# EAGLE board SB V1.2 (EAGLE 9.6.2), part 1 of 2
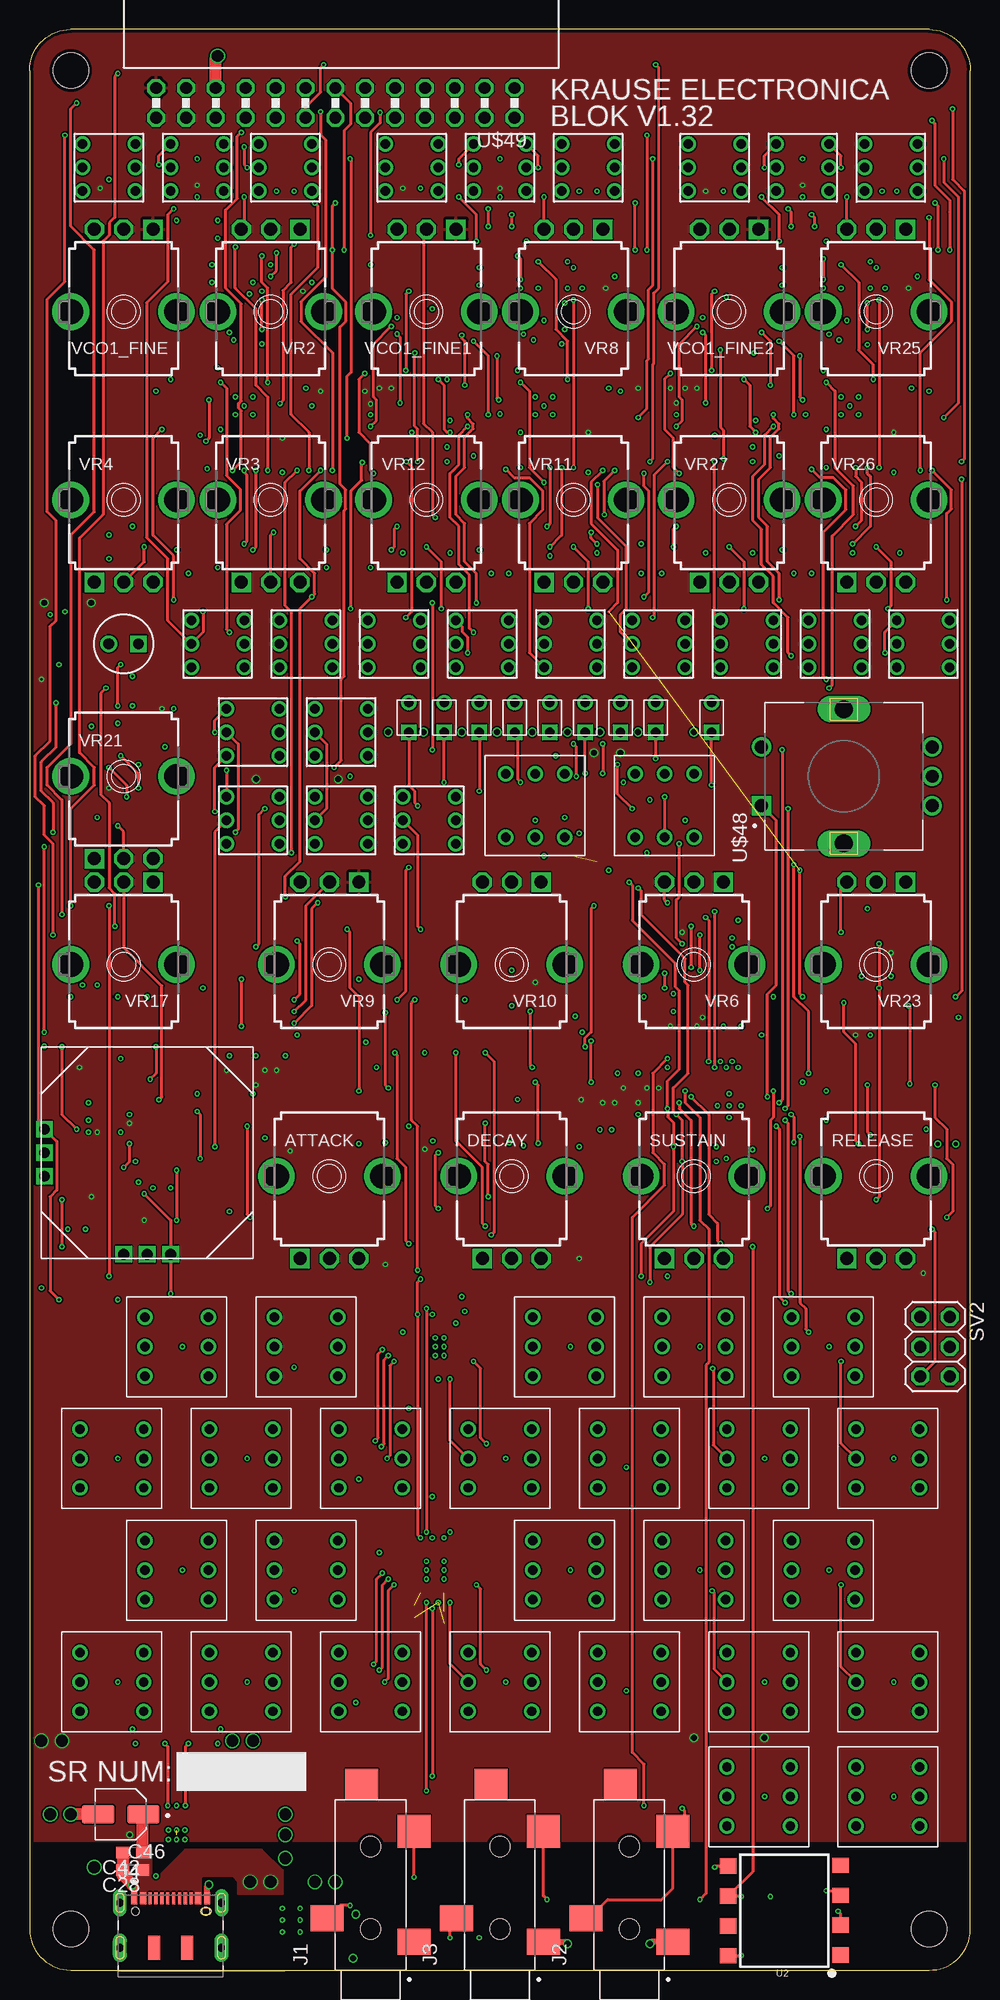
[diagram p5: board, top side]
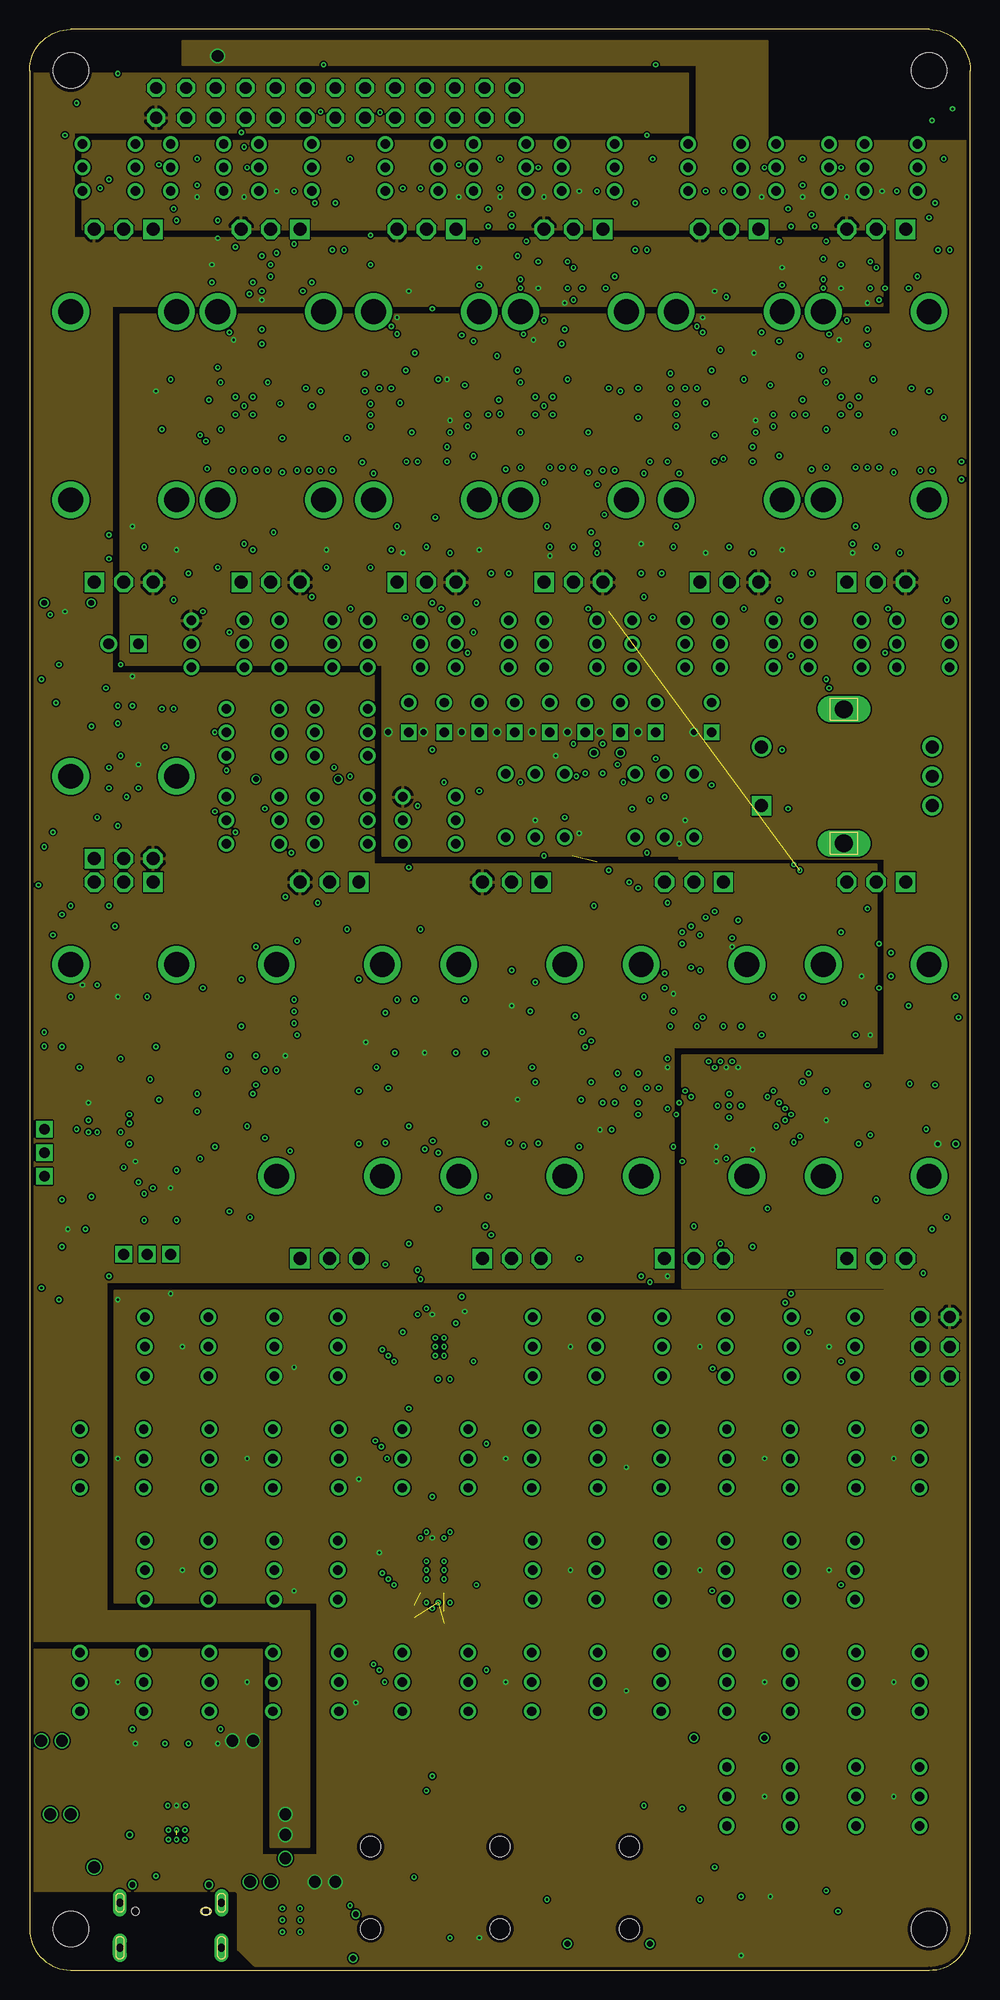
[diagram p6: board, inner layer Route2]
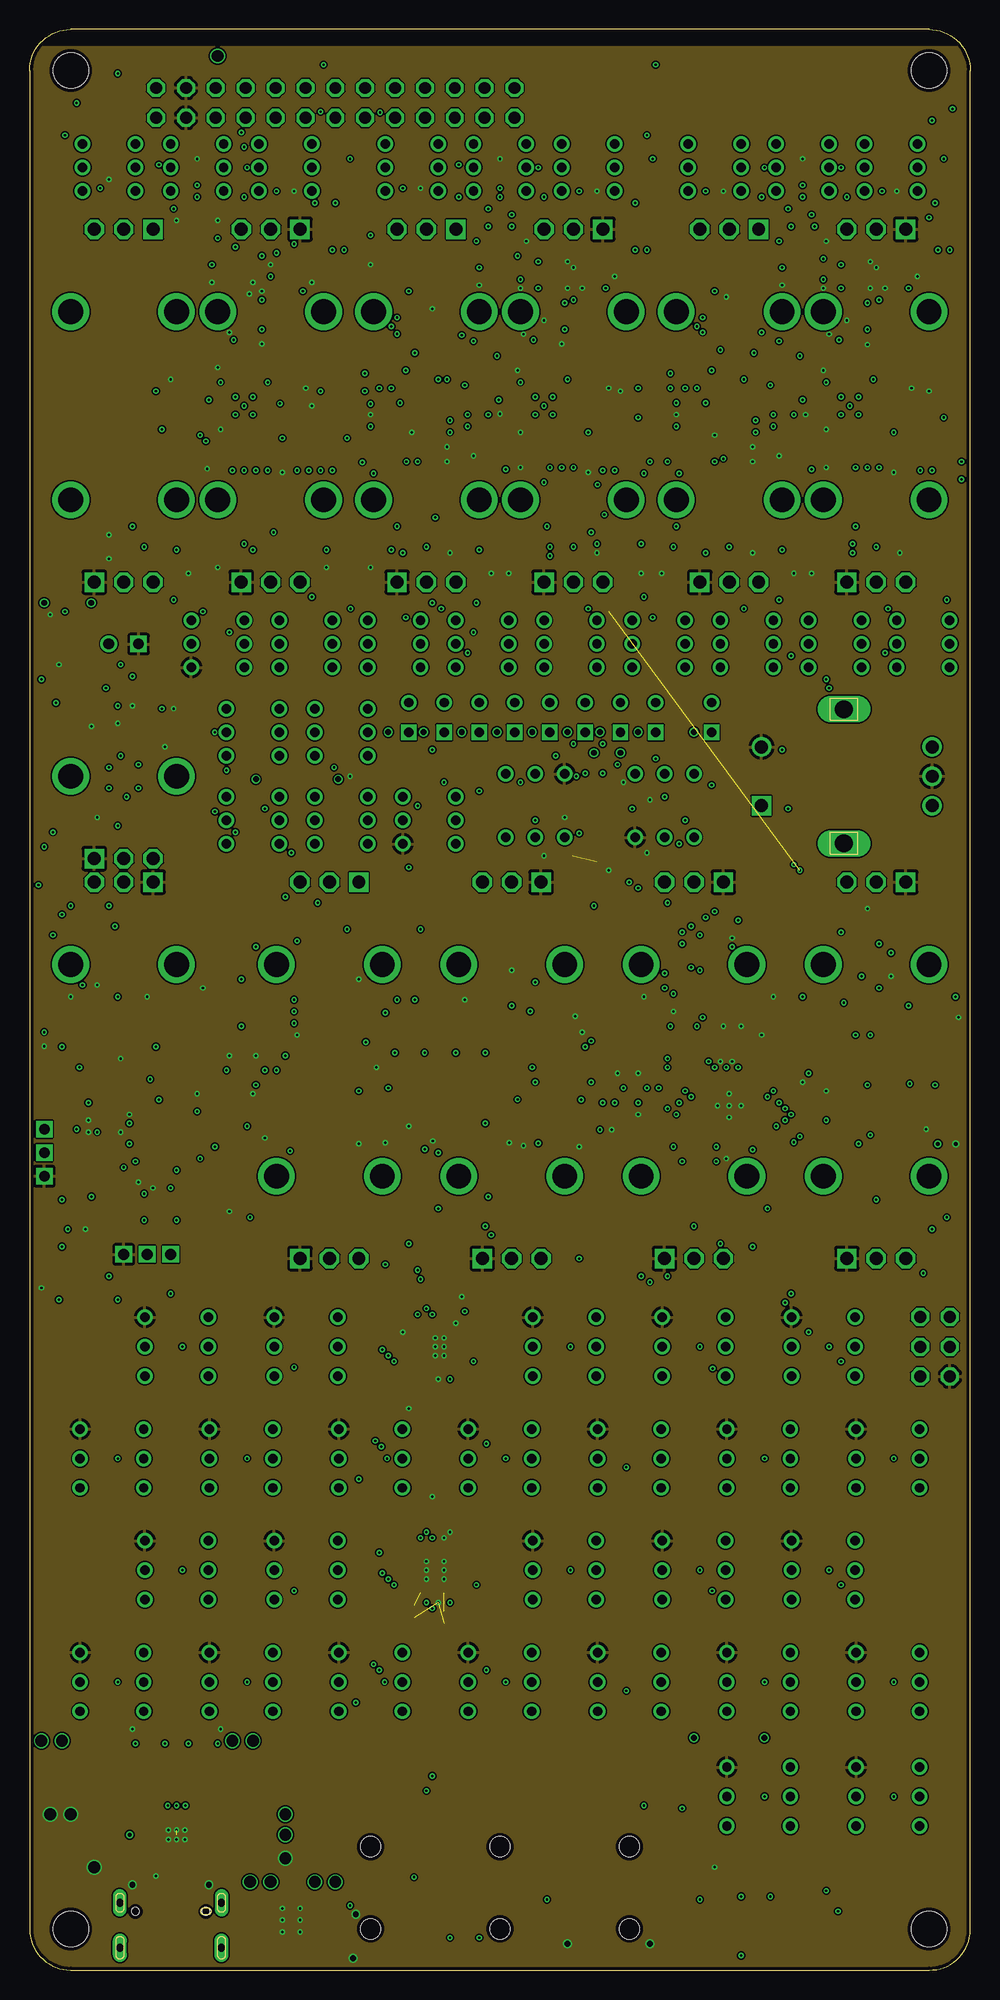
[diagram p7: board, inner layer Route15]
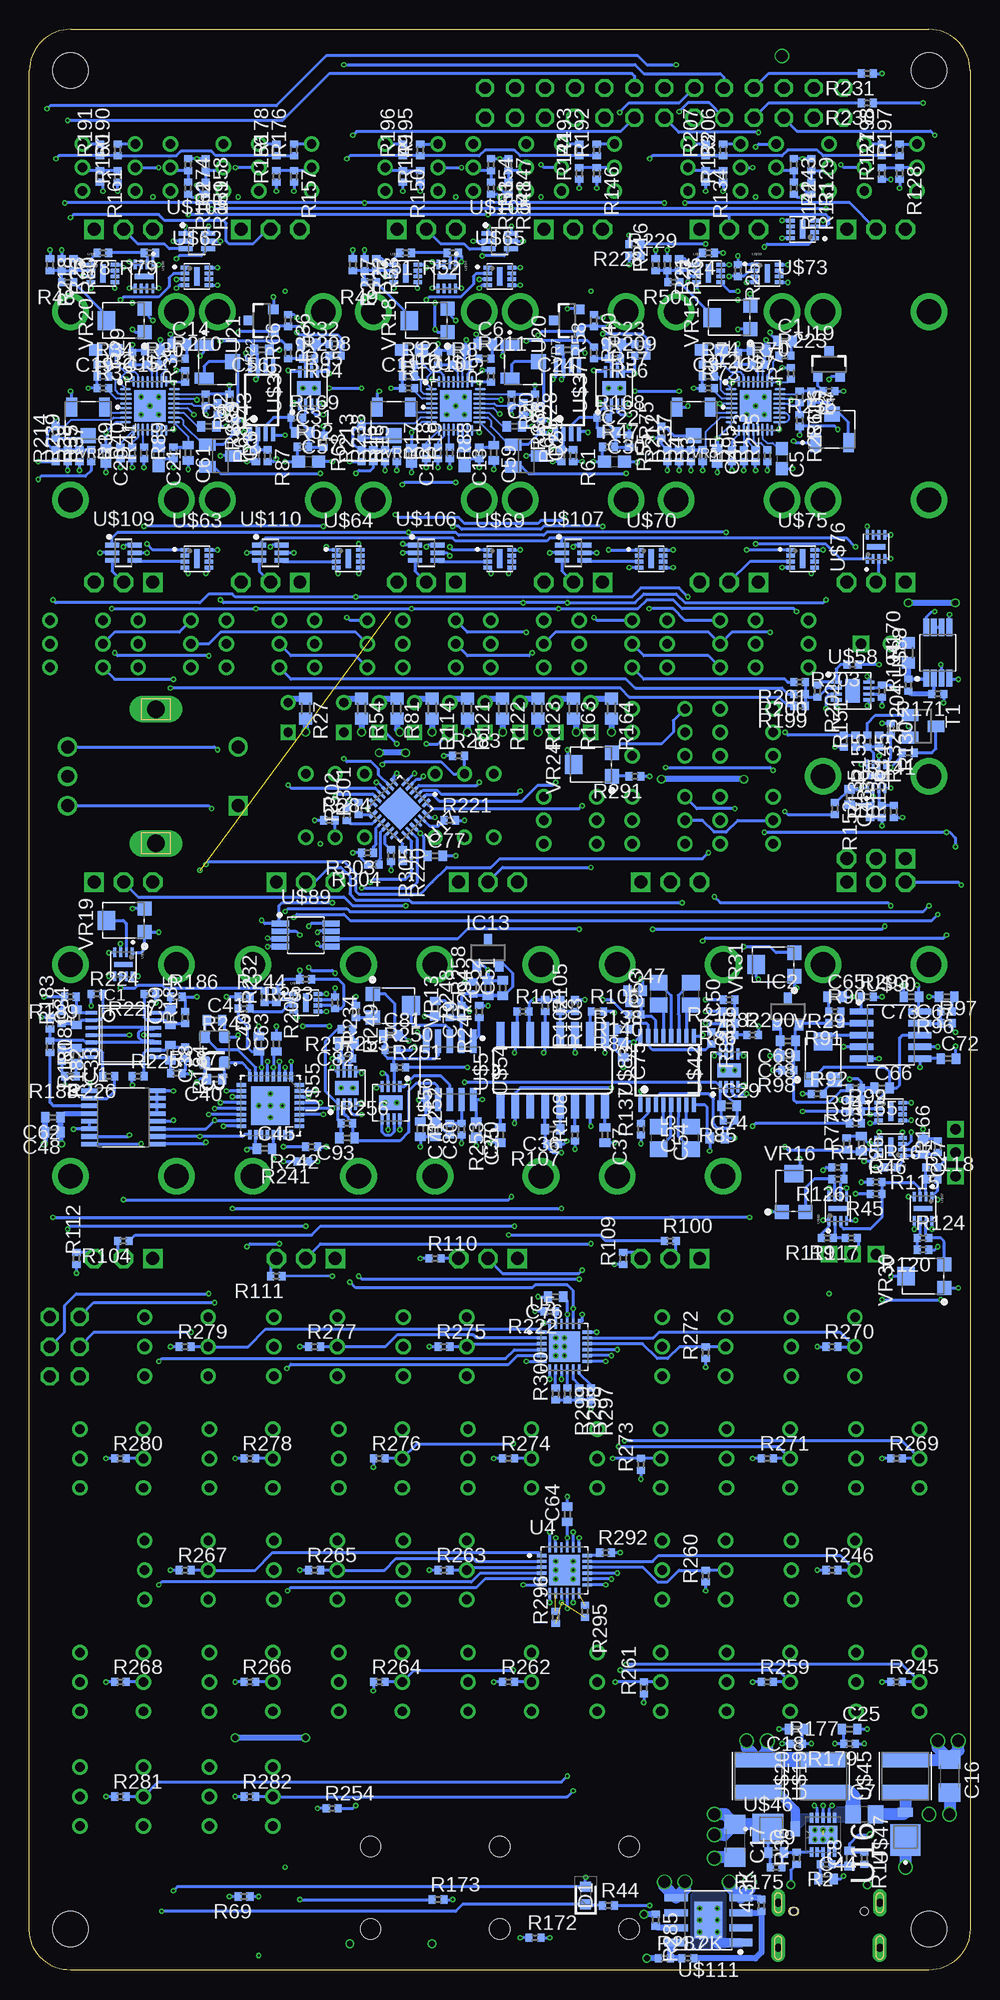
[diagram p8: board, bottom side, seen from below]

Size 80 x 165 mm. Coordinates in mm from the lower left corner, seen from the top.
Outline: 3.5,0 76.5,0 arc90 80,3.4 80,161.5 arc90 76.5,165 3.5,165 arc90 0,161.5 0,3.5 arc90 3.5,0
Copper layers (1+2*15+16): Top 0.035mm / dielectric 0.18mm / Route2 0.017mm / dielectric 1.2mm / Route15 0.017mm / dielectric 0.18mm / Bottom 0.035mm
Design rules "default *": minimum track width 5mil, minimum drill 0.2mm, track to track 5mil, track to pad 0.2mm, pad to pad 5mil, via to via 10mil, smd to smd 5mil, copper to edge 0.3mm, drill to drill 0.5mm, minimum pad ring 10mil, minimum via ring 0.125mm, stop-mask expansion 4mil, vias tented up to drill 0mil, thermal gap 10mil
Holes 3 mm at 76.5,3.5 3.5,3.5 3.5,161.5 76.5,161.5

## Footprints (pad centres in the part's own frame; a part is rotated, then mirrored left to right if it is on the bottom)
R0402 = smd 0.6 x 0.7: 1 -0.5,0; 2 0.5,0
TL2203 = drill 0.8: P$1 -2.25,2; P$2 -2.25,0; P$3 -2.25,-2; P$4 2.25,2; P$5 2.25,0; P$6 2.25,-2
9MM_SNAP-IN_POT = drill 1.1 square: 1 -2.5,-7 | drill 1.1 octagon: 2 0,-7; 3 2.5,-7 | drill 2.1 pad 2.794: CHASSIS1 -4.5,0; CHASSIS2 4.5,0
C0402 = smd 0.7 x 0.9: 1 -0.65,0; 2 0.65,0
C0603 = smd 1.1 x 1: 1 -0.85,0; 2 0.85,0
C0805 = smd 1.3 x 1.5: 1 -0.95,0; 2 0.95,0
C1206 = smd 1.6 x 1.8: 1 -1.4,0; 2 1.4,0
CAPAE430X610N = smd 2.76 x 1.58: 1 -1.925,0; 2 1.925,0
DIOC1608X75N = smd 0.85 x 0.95: 1 -0.75,0; 2 0.75,0
TSSOP14 = smd 0.305 x 0.991: 1 -1.905,-2.718; 2 -1.27,-2.718; 3 -0.635,-2.718; 4 0,-2.718; 5 0.635,-2.718; 6 1.27,-2.718; 7 1.905,-2.718; 8 1.905,2.718; 9 1.27,2.718; 10 0.635,2.718; 11 0,2.718; 12 -0.635,2.718; 13 -1.27,2.718; 14 -1.905,2.718
DBZ_R-PDSO-G3 = smd 0.7 x 1: 1 -0.95,-1.1; 2 0.95,-1.1; 3 0,1.1
CUI_SJ-3524-SMT = smd 2.2 x 2.8: 1 -1.1,-3.7; 3 0.9,3.7 | smd 2.8 x 2.8: 2 8.3,-3.7 | smd 2.6 x 2.8: 4 12.3,0.75 | hole 1.7: 0,0; 7,0
JAE_DX07S016JA1R1500 = smd 0.52 x 1: 1 -3.1,1.1; 2 -2.35,1.1; 11 2.35,1.1; 12 3.1,1.1 | smd 0.27 x 1: 3 -1.75,1.1; 4 -1.25,1.1; 5 -0.75,1.1; 6 -0.25,1.1; 7 0.25,1.1; 8 0.75,1.1; 9 1.25,1.1; 10 1.75,1.1 | smd 1 x 2: S1 -1.4,-3.1; S2 1.4,-3.1 | drill 0.65 long: S3 -4.32,0.725; S4 4.32,0.725 | drill 0.65 pad 1.2 long: S5 -4.32,-3.1; S6 4.32,-3.1 | hole 0.6: 3,0 | hole 0.63: 3,0; -3,0
SOT23-BEC = smd 1 x 1.4: B -0.95,-1.1; C 0,1.1; E 0.95,-1.1
R0603 = smd 1 x 1.1: 1 -0.85,0; 2 0.85,0
2X03 = drill 1.016 octagon: 1 -2.54,-1.27; 2 -2.54,1.27; 3 0,-1.27; 4 0,1.27; 5 2.54,-1.27; 6 2.54,1.27
SOT23 = smd 1 x 1.4: 1 -0.95,-1.1; 2 0.95,-1.1; 3 0,1.1
SOP65P640X120-16N = smd 1.57 x 0.41: 1 -2.87,2.275; 2 -2.87,1.625; 3 -2.87,0.975; 4 -2.87,0.325; 5 -2.87,-0.325; 6 -2.87,-0.975; 7 -2.87,-1.625; 8 -2.87,-2.275; 9 2.87,-2.275; 10 2.87,-1.625; 11 2.87,-0.975; 12 2.87,-0.325; 13 2.87,0.325; 14 2.87,0.975; 15 2.87,1.625; 16 2.87,2.275
8-SMD = smd 1.3 x 1.4: 1 -3.96,-4.96; 2 -1.42,-4.96; 3 1.12,-4.96; 4 3.66,-4.96; 5 3.59,4.58; 6 1.05,4.58; 7 -1.49,4.58; 8 -4.03,4.58
QFN50P500X500X100-33N = smd 0.813 x 0.305: 1 -2.464,1.753; 2 -2.464,1.245; 3 -2.464,0.762; 4 -2.464,0.254; 5 -2.464,-0.254; 6 -2.464,-0.762; 7 -2.464,-1.245; 8 -2.464,-1.753; 17 2.464,-1.753; 18 2.464,-1.245; 19 2.464,-0.762; 20 2.464,-0.254; 21 2.464,0.254; 22 2.464,0.762; 23 2.464,1.245; 24 2.464,1.753 | smd 0.305 x 0.813: 9 -1.753,-2.464; 10 -1.245,-2.464; 11 -0.762,-2.464; 12 -0.254,-2.464; 13 0.254,-2.464; 14 0.762,-2.464; 15 1.245,-2.464; 16 1.753,-2.464; 25 1.753,2.464; 26 1.245,2.464; 27 0.762,2.464; 28 0.254,2.464; 29 -0.254,2.464; 30 -0.762,2.464; 31 -1.245,2.464; 32 -1.753,2.464 | smd 3.251 x 3.251: 33 0,0
QFN50P400X400X80-25N = smd 0.86 x 0.27: 1 -1.935,1.25; 2 -1.935,0.75; 3 -1.935,0.25; 4 -1.935,-0.25; 5 -1.935,-0.75; 6 -1.935,-1.25; 13 1.935,-1.25; 14 1.935,-0.75; 15 1.935,-0.25; 16 1.935,0.25; 17 1.935,0.75; 18 1.935,1.25 | smd 0.27 x 0.86: 7 -1.25,-1.935; 8 -0.75,-1.935; 9 -0.25,-1.935; 10 0.25,-1.935; 11 0.75,-1.935; 12 1.25,-1.935; 19 1.25,1.935; 20 0.75,1.935; 21 0.25,1.935; 22 -0.25,1.935; 23 -0.75,1.935; 24 -1.25,1.935 | smd 2.6 x 2.6: 25 0,0
DFN300X300X80-11N = smd 0.813 x 0.305: 1 -1.448,0.991; 2 -1.448,0.508; 3 -1.448,0; 4 -1.448,-0.508; 5 -1.448,-0.991; 6 1.448,-0.991; 7 1.448,-0.508; 8 1.448,0; 9 1.448,0.508; 10 1.448,0.991 | smd 1.549 x 2.388: 11 0,0
SOT23-3 = smd 0.8 x 0.9: 1 -0.95,-1; 2 0.95,-1; 3 0,1.1
QFN40P400X400X80-33T270N = smd 0.951 x 0.22: 1 -2.089,1.4; 8 -2.089,-1.4; 24 2.089,1.4 | smd 1.051 x 0.22: 2 -2.039,1; 3 -2.039,0.6; 4 -2.039,0.2; 5 -2.039,-0.2; 6 -2.039,-0.6; 7 -2.039,-1; 17 2.039,-1.4; 18 2.039,-1; 19 2.039,-0.6; 20 2.039,-0.2; 21 2.039,0.2; 22 2.039,0.6; 23 2.039,1 | smd 0.22 x 0.951: 9 -1.4,-2.089; 16 1.4,-2.089; 25 1.4,2.089; 32 -1.4,2.089 | smd 0.22 x 1.051: 10 -1,-2.039; 11 -0.6,-2.039; 12 -0.2,-2.039; 13 0.2,-2.039; 14 0.6,-2.039; 15 1,-2.039; 26 1,2.039; 27 0.6,2.039; 28 0.2,2.039; 29 -0.2,2.039; 30 -0.6,2.039; 31 -1,2.039 | smd 2.7 x 2.7: 33 0,0
SON50P200X200X60-9N = smd 0.74 x 0.26: 1 -1.02,0.75; 2 -1.02,0.25; 3 -1.02,-0.25; 4 -1.02,-0.75; 5 1.02,-0.75; 6 1.02,-0.25; 7 1.02,0.25; 8 1.02,0.75 | smd 0.45 x 1.6: 9 0,0
SO16 = smd 0.66 x 2.032: 1 -4.445,-3.073; 2 -3.175,-3.073; 3 -1.905,-3.073; 4 -0.635,-3.073; 5 0.635,-3.073; 6 1.905,-3.073; 7 3.175,-3.073; 8 4.445,-3.073; 9 4.445,3.073; 10 3.175,3.073; 11 1.905,3.073; 12 0.635,3.073; 13 -0.635,3.073; 14 -1.905,3.073; 15 -3.175,3.073; 16 -4.445,3.073
LT2201 = drill 0.8: 1 -2.7,2.5; 2 -2.7,0; 3 -2.7,-2.5; 4 2.7,2.5; 5 2.7,0; 6 2.7,-2.5
INDDFN400X400X180-2N = smd 1.312 x 3.812: 1 -1.4,0; 2 1.4,0
TSSOP8 = smd 1.2 x 0.35: 1 -2.925,0.975; 2 -2.925,0.325; 3 -2.925,-0.325; 4 -2.925,-0.975; 5 2.925,-0.975; 6 2.925,-0.325; 7 2.925,0.325; 8 2.925,0.975
SON50P300X300X80-9T120X200N = smd 0.96 x 0.27: 1 -1.385,0.75; 2 -1.385,0.25; 3 -1.385,-0.25; 4 -1.385,-0.75; 5 1.385,-0.75; 6 1.385,-0.25; 7 1.385,0.25; 8 1.385,0.75 | smd 1.2 x 2: 9 0,0
DIO_MBRM110LT1G = smd 2.67 x 2.54: 1 -0.699,0 | smd 0.762 x 1.27: 2 1.653,0
XDCR_PEC11R-4215F-S0024 = drill 1.1 square: 1 -2.5,7 | drill 1.1: 2 2.5,7; A -2.5,-7.5; B 2.5,-7.5; COM 0,-7.5 | drill 1.5 long: S1 -5.7,0; S2 5.7,0
FE13-2W = drill 1.016 octagon: 1 -15.24,1.27; 2 -15.24,-1.27; 3 -12.7,1.27; 4 -12.7,-1.27; 5 -10.16,1.27; 6 -10.16,-1.27; 7 -7.62,1.27; 8 -7.62,-1.27; 9 -5.08,1.27; 10 -5.08,-1.27; 11 -2.54,1.27; 12 -2.54,-1.27; 13 0,1.27; 14 0,-1.27; 15 2.54,1.27; 16 2.54,-1.27; 17 5.08,1.27; 18 5.08,-1.27; 19 7.62,1.27; 20 7.62,-1.27; 21 10.16,1.27; 22 10.16,-1.27; 23 12.7,1.27; 24 12.7,-1.27; 25 15.24,1.27; 26 15.24,-1.27
WP914HDT = drill 0.8: A -1.27,0 | drill 0.8 square: C 1.27,0
SOP100P600X150-10N = smd 1.968 x 0.547: 1 -2.473,2; 2 -2.473,1; 3 -2.473,0; 4 -2.473,-1; 5 -2.473,-2; 6 2.473,-2; 7 2.473,-1; 8 2.473,0; 9 2.473,1; 10 2.473,2
WP483SRSGW = drill 0.9: P$1 -1.27,0 | drill 0.9 square: P$2 1.27,0
TSSOP16 = smd 0.35 x 1.2: 1 -2.275,-2.925; 2 -1.625,-2.925; 3 -0.975,-2.925; 4 -0.325,-2.925; 5 0.325,-2.925; 6 0.975,-2.925; 7 1.625,-2.925; 8 2.275,-2.925; 9 2.275,2.925; 10 1.625,2.925; 11 0.975,2.925; 12 0.325,2.925; 13 -0.325,2.925; 14 -0.975,2.925; 15 -1.625,2.925; 16 -2.275,2.925
ADAFRUIT-JOYSTICK = drill 0.9 square: P$1 -2,-8.75; P$2 0,-8.75; P$3 2,-8.75; P$4 8.65,2; P$5 8.65,0; P$6 8.65,-2
SOP65P490X110-8N = smd 1.471 x 0.497: 1 -2.15,0.975; 2 -2.15,0.325; 3 -2.15,-0.325; 4 -2.15,-0.975; 5 2.15,-0.975; 6 2.15,-0.325; 7 2.15,0.325; 8 2.15,0.975
SOP65P490X110-8N' = smd 1.471 x 0.481: 1 -2.15,0.975; 2 -2.15,0.325; 3 -2.15,-0.325; 4 -2.15,-0.975; 5 2.15,-0.975; 6 2.15,-0.325; 7 2.15,0.325; 8 2.15,0.975
SOT65P210X110-6N = smd 1.186 x 0.397: 1 -0.962,0.65; 2 -0.962,0; 3 -0.962,-0.65; 4 0.962,-0.65; 5 0.962,0; 6 0.962,0.65
SOIC127P600X170-9T240X310N = smd 1.968 x 0.602: 1 -2.75,1.905; 2 -2.75,0.635; 3 -2.75,-0.635; 4 -2.75,-1.905; 5 2.75,-1.905; 6 2.75,-0.635; 7 2.75,0.635; 8 2.75,1.905 | smd 2.4 x 3.1: 9 0,0
TRIM_3223W-1-501 = smd 0.9 x 1.6: 1 -1.4,-1.14; 3 1.4,-1.14 | smd 1.3 x 1.3: 2 0,1.29
TRIMMER_TC33X-2-103G = smd 1.2 x 1.2: 1 -1,-1.8; 3 1,-1.8 | smd 1.6 x 1.5: 2 0,1.45
OSCSC320X250X100N = smd 0.98 x 1.1: 1 -0.85,1.1; 2 -0.85,-1.1; 3 0.85,-1.1; 4 0.85,1.1

## Placement (x,y rotation side)
1.2K  1K  [R0402]  24,1 0 bottom
1_DOWN  TL2203  [TL2203]  6.75,153.25 0 top
1_UP  TL2203  [TL2203]  21.75,153.25 0 top
2_DOWN  TL2203  [TL2203]  32.5,153.25 0 top
2_UP  TL2203  [TL2203]  47.5,153.25 0 top
3_DOWN  TL2203  [TL2203]  58.25,153.25 0 top
3_UP  TL2203  [TL2203]  73.25,153.25 0 top
4.3K  20K  [R0402]  17.75,5.5 90 bottom
ATTACK  100K  [9MM_SNAP-IN_POT]  25.5,67.5 0 top
C1  10nF  [C0402]  15.75,138.5 0 bottom
C2  0.1uF  [C0402]  18,137.75 180 bottom
C3  10uF  [C0603]  22,137.75 180 bottom
C4  0.1uF  [C0402]  21.5,128.75 270 bottom
C5  3.9nF  [C0603]  16,128.5 270 bottom
C6  10nF  [C0402]  41.25,138.25 0 bottom
C7  1uF  [C0805]  9,13.25 0 bottom
C8  56pF  [C0402]  10.25,9.5 90 bottom
C9  56pF  [C0402]  16.5,10 0 bottom
C10  0.1uF  [C0402]  43.5,137.75 180 bottom
C11  10uF  [C0603]  47.5,137.75 180 bottom
C12  0.1uF  [C0402]  47.5,128.75 270 bottom
C13  3.9nF  [C0603]  43,128.75 270 bottom
C14  10nF  [C0402]  67.25,138.25 0 bottom
C15  0.1uF  [C0402]  69.5,137.75 180 bottom
C16  4.7uF  [C1206]  1.75,16.5 270 bottom
C17  4.7uF  [C1206]  20,11 270 bottom
C18  0.33uF  [C0402]  14.75,20.5 180 bottom
C19  10uF  [C0603]  73.5,137.75 180 bottom
C20  0.1uF  [C0402]  73.5,128.75 270 bottom
C21  3.9nF  [C0603]  69,128.75 270 bottom
C22  100pF  [C0402]  30.75,130.75 0 bottom
C23  100pF  [C0402]  30.25,138.25 0 bottom
C24  100pF  [C0402]  34.25,137.75 180 bottom
C25  0.33uF  [C0402]  10.25,20.5 0 bottom
C26  100p  [C0402]  9.25,70.25 270 bottom
C27  47p  [C0402]  4,70 270 bottom
C28  10nF  [C0603]  8.75,8.5 180 top
C29  100pF  [C0402]  20.5,73.5 0 bottom
C30  10uF  [C0603]  30.25,128.25 0 bottom
C31  100pF  [C0402]  56.75,130.75 0 bottom
C32  100pF  [C0402]  56.25,138.25 0 bottom
C33  18pF  [C0402]  76,77.75 270 bottom
C34  18pF  [C0402]  76,81 90 bottom
C35  39nF  [C0402]  39.95,71 270 bottom
C36  3nF  [C0402]  35.5,71.5 180 bottom
C37  10nF  [C0402]  31.05,71 270 bottom
C38  18pF  [C0402]  68,78 270 bottom
C39  18pF  [C0402]  68,81 90 bottom
C40  10pF  [C0402]  64.25,75.75 180 bottom
C41  10pF  [C0402]  64.25,80.75 0 bottom
C42  100nF  [C0603]  8.75,10 180 top
C43  100nF  [C0402]  10.25,99.75 270 bottom
C44  100nF  [C0402]  12.25,7.75 0 bottom
C45  100nF  [C0402]  60,69.85 0 bottom
C46  EEE-FK1E100R  [CAPAE430X610N]  7.75,13.25 180 top
C47  10nF  [C0402]  28.5,83.25 0 bottom
C48  100n  [C0402]  78,71.25 180 bottom
C49  100nF  [C0402]  60.5,78.75 90 bottom
C50  6.8nF  [C0805]  23.75,83 270 bottom
C51  470pF  [C0402]  39.75,83.5 90 bottom
C52  470pF  [C0402]  41,83.5 90 bottom
C53  6.8nF  [C0805]  26.5,83 90 bottom
C54  560pF  [C0805]  26.5,70.75 270 bottom
C55  6.8nF  [C0805]  23.75,70.75 90 bottom
C56  100pF  [C0402]  60.25,137.75 180 bottom
C57  10uF  [C0603]  56.25,128.25 0 bottom
C58  10nF  [C0402]  38.75,131.25 0 bottom
C59  10nF  [C0402]  40.5,129 270 bottom
C60  10nF  [C0402]  64.75,131.25 0 bottom
C61  10nF  [C0402]  66.5,129 270 bottom
C62  220nF  [C0402]  78,72.5 180 bottom
C63  [C0402]  59,78.75 90 bottom
C64  100nF  [C0402]  34.25,38.75 90 bottom
C65  560p  [C0402]  11.5,82.75 0 bottom
C66  47p  [C0402]  7.5,75 0 bottom
C67  560p  [C0402]  2,82.75 180 bottom
C68  470pF  [C0402]  15.5,77.75 180 bottom
C69  470pF  [C0402]  15.5,79 180 bottom
C70  10nF  [C0402]  42,71.5 270 bottom
C71  10nF  [C0402]  46.75,71.5 270 bottom
C72  10nF  [C0402]  1.85,77.5 0 bottom
C73  10nF  [C0402]  5,82.75 180 bottom
C74  10nF  [C0402]  21.5,70.75 0 bottom
C75  10nF  [C0402]  29.5,78.25 270 bottom
C76  100nF  [C0402]  35.25,57.25 180 bottom
C77  100nF  [C0402]  45.5,94.75 0 bottom
C79  560p  [C0402]  45.5,81.75 270 bottom
C80  560p  [C0402]  45.5,71.5 270 bottom
C81  47p  [C0402]  49.25,79.5 0 bottom
C82  100p  [C0402]  53,78.75 180 bottom
C93  47p  [C0402]  53,70.75 180 bottom
D1  TS4148C_RZG  [DIOC1608X75N]  32.7,6.35 90 bottom
DECAY  100K  [9MM_SNAP-IN_POT]  41,67.5 0 top
IC1  TL074  [TSSOP14]  72,79.5 270 bottom
IC2  LM4040C25  [DBZ_R-PDSO-G3]  15.5,81.5 0 bottom
IC13  LM4040C25  [DBZ_R-PDSO-G3]  41,86.5 0 bottom
J1  SJ-3524-SMT  [CUI_SJ-3524-SMT]  29,3.5 90 top
J2  SJ-3524-SMT  [CUI_SJ-3524-SMT]  51,3.5 90 top
J3  SJ-3524-SMT  [CUI_SJ-3524-SMT]  40,3.5 90 top
J4  DX07S016JA1R1500  [JAE_DX07S016JA1R1500]  12,5 0 top
Q2  2N7002SOT-23  [SOT23-BEC]  37.75,128.75 270 bottom
Q3  2N7002SOT-23  [SOT23-BEC]  63.75,128.75 270 bottom
R1  20K  [R0402]  19.75,137 90 bottom
R2  15K  [R0402]  12.25,9 180 bottom
R3  49.9K  [R0402]  22.75,128.75 90 bottom
R4  49.9K  [R0402]  23.75,128.75 90 bottom
R5  100K  [R0402]  20.25,128.75 90 bottom
R6  20K  [R0402]  45.25,137 90 bottom
R7  22.1K  [R0402]  13.5,133.75 270 bottom
R8  20K  [R0402]  43.5,136.5 0 bottom
R9  10K  [R0402]  40.75,135.5 90 bottom
R10  4.75K  [R0402]  47.75,135.5 0 bottom
R11  4.75K  [R0402]  47.75,134.5 0 bottom
R12  4.02K  [R0402]  47.75,136.5 0 bottom
R13  267K  [R0402]  51.75,130.75 270 bottom
R14  182K  [R0402]  9,9.5 270 bottom
R15  49.9K  [R0402]  48.75,128.75 90 bottom
R16  49.9K  [R0402]  49.75,128.75 90 bottom
R17  100K  [R0402]  46.25,129 90 bottom
R18  100K  [R0402]  45.25,129 90 bottom
R19  100K  [R0402]  44.25,129 90 bottom
R20  499K  [R0402]  39,133.5 270 bottom
R21  20K  [R0402]  25.75,145 270 bottom
R22  20K  [R0402]  51.5,145 270 bottom
R23  20K  [R0402]  77.25,145 270 bottom
R24  100K  [R0402]  22.25,146 180 bottom
R25  20K  [R0402]  19.75,144.5 270 bottom
R26  10K  [R0402]  24.75,145 270 bottom
R27  300  [R0603]  56.5,107.25 270 bottom
R28  22.1K  [R0402]  37,133.5 270 bottom
R29  20K  [R0402]  71.25,137 90 bottom
R30  20K  [R0402]  69.5,136.5 0 bottom
R31  10K  [R0402]  66.75,135.5 90 bottom
R32  4.75K  [R0402]  73.75,135.5 0 bottom
R33  4.75K  [R0402]  73.75,134.5 0 bottom
R34  4.02K  [R0402]  73.75,136.5 0 bottom
R35  267K  [R0402]  77.75,130.75 270 bottom
R36  4.99K  [R0402]  14.75,9.5 90 bottom
R37  49.9K  [R0402]  74.75,128.75 90 bottom
R38  49.9K  [R0402]  75.75,128.75 90 bottom
R39  100K  [R0402]  72.25,129 90 bottom
R40  100K  [R0402]  71.25,129 90 bottom
R41  100K  [R0402]  70.25,129 90 bottom
R42  499K  [R0402]  65,133.5 270 bottom
R43  22.1K  [R0402]  63,133.5 270 bottom
R44  220  [R0402]  30.75,5.5 0 bottom
R45  10K  [R0402]  8,66 180 bottom
R46  10K  [R0402]  8,67 0 bottom
R47  20K  [R0402]  30.75,129.5 0 bottom
R48  10K  [R0402]  76.75,143.5 180 bottom
R49  10K  [R0402]  51,143.5 180 bottom
R50  10K  [R0402]  25.2,143.5 180 bottom
R51  100K  [R0402]  48,146 180 bottom
R52  20K  [R0402]  44,146 180 bottom
R53  10K  [R0402]  50.5,145 270 bottom
R54  300  [R0603]  51.75,107.25 270 bottom
R55  20K  [R0402]  29,130 270 bottom
R56  20K  [R0402]  28,137.25 180 bottom
R57  20K  [R0402]  28,138.25 180 bottom
R58  500K  [R0402]  32,137.5 90 bottom
R59  10K  [R0402]  36.5,131.25 270 bottom
R60  100  [R0402]  34.75,128.75 90 bottom
R61  100K  [R0402]  33.75,128.75 270 bottom
R62  20K  [R0402]  56.75,129.5 0 bottom
R63  20K  [R0402]  55,130 270 bottom
R64  20K  [R0402]  54,137.25 180 bottom
R65  20K  [R0402]  54,138.25 180 bottom
R66  500K  [R0402]  58,137.5 90 bottom
R67  10K  [R0402]  62.5,131.25 270 bottom
R68  100  [R0402]  60.75,128.75 90 bottom
R69  10K  [R0402]  61.75,6.25 180 bottom
R70  20K  [R0402]  18,136.5 0 bottom
R71  10K  [R0402]  15.25,135.75 90 bottom
R72  4.75K  [R0402]  22.25,135.5 0 bottom
R73  4.75K  [R0402]  22.25,134.5 0 bottom
R74  4.02K  [R0402]  22.25,136.5 0 bottom
R75  267K  [R0402]  26.25,130.75 90 bottom
R76  100K  [R0402]  20.5,81.5 180 bottom
R77  5.1k  [R0402]  10.5,70.25 90 bottom
R78  100K  [R0402]  73.75,146 180 bottom
R79  20K  [R0402]  69.75,146 180 bottom
R80  10K  [R0402]  76.25,145 270 bottom
R81  300  [R0603]  48.75,107.25 270 bottom
R82  100K  [R0402]  20.5,79.5 0 bottom
R83  133K  [R0402]  22,79.25 270 bottom
R84  1K  [R0402]  29.5,80 180 bottom
R85  33.2K  [R0402]  20.5,72.25 180 bottom
R86  100K  [R0402]  20.5,80.5 180 bottom
R87  100K  [R0402]  59.75,128.75 270 bottom
R88  10K  [R0402]  41.75,129 90 bottom
R89  10K  [R0402]  67.75,129 90 bottom
R90  510  [R0402]  11.5,81.5 0 bottom
R91  49.9k  [R0402]  11.5,80.5 180 bottom
R92  510  [R0402]  13,74.5 0 bottom
R93  100k  [R0402]  9.75,74 180 bottom
R94  20M  [R0402]  9.75,75 180 bottom
R95  100K  [R0402]  19.25,128.75 90 bottom
R96  510  [R0402]  2,81.5 180 bottom
R97  100k  [R0402]  2,80.5 0 bottom
R98  24K  [R0402]  15.5,76.5 180 bottom
R99  100K  [R0402]  9.75,73 0 bottom
R100  10K  [R0402]  25.5,62 0 bottom
R101  470R  [R0402]  38.03,81.5 0 bottom
R102  470R  [R0402]  36.13,82 270 bottom
R103  470R  [R0402]  34.87,82 270 bottom
R104  10K  [R0402]  72,62 180 bottom
R105  10K  [R0402]  33.59,82 90 bottom
R106  30K  [R0402]  31.69,81.5 0 bottom
R107  10K  [R0402]  35.5,70.25 180 bottom
R108  620R  [R0402]  33.59,71 90 bottom
R109  4.3M  [R0402]  29.5,60.5 90 bottom
R110  20M  [R0402]  45.5,60.5 0 bottom
R111  240K  [R0402]  59,59 180 bottom
R112  1.8M  [R0402]  76,60.5 90 bottom
R113  100K  [R0402]  18.25,128.75 90 bottom
R114  300  [R0603]  45.75,107.25 270 bottom
R115  10K  [R0402]  3.25,68.25 180 bottom
R116  499K  [R0402]  14.5,133.75 270 bottom
R117  10K  [R0402]  10.1,62.25 180 bottom
R118  10K  [R0402]  3.25,67.25 0 bottom
R119  10K  [R0402]  12.15,62.25 180 bottom
R120  10K  [R0402]  4,61.25 180 bottom
R121  300  [R0603]  42.75,107.25 270 bottom
R122  300  [R0603]  39.75,107.25 270 bottom
R123  300  [R0603]  36.75,107.25 270 bottom
R124  10K  [R0402]  4,62.25 0 bottom
R125  10K  [R0402]  11.25,68.25 0 bottom
R126  10K  [R0402]  11.25,67.25 180 bottom
R127  1K  [R0402]  7.5,152.75 90 bottom
R128  11K  [R0402]  6,152.75 270 bottom
R129  1K  [R0402]  13.5,153.5 270 bottom
R130  47K  [R0402]  6.75,105.5 270 bottom
R131  11K  [R0402]  13.5,151.5 270 bottom
R132  47K  [R0402]  7.75,104.5 270 bottom
R133  12K  [R0402]  21,152.5 90 bottom
R134  3K  [R0402]  22.5,152.5 270 bottom
R135  100K  [R0402]  8.5,98.5 90 bottom
R136  47K  [R0402]  6.5,98.5 90 bottom
R137  200  [R0402]  28,71.5 90 bottom
R138  499  [R0402]  28.5,82.25 180 bottom
R139  47K  [R0402]  7.5,98.5 90 bottom
R140  26.7K  [R0402]  28.5,81.25 180 bottom
R141  47K  [R0402]  5.25,103.5 180 bottom
R142  12K  [R0402]  15,151.5 270 bottom
R143  3K  [R0402]  15,153.5 270 bottom
R144  1K  [R0402]  33.25,152.75 90 bottom
R145  100K  [R0402]  8.75,104.5 270 bottom
R146  11K  [R0402]  31.75,152.75 270 bottom
R147  1K  [R0402]  39.25,153.5 270 bottom
R148  11K  [R0402]  39.25,151.5 270 bottom
R149  12K  [R0402]  46.75,152.5 90 bottom
R150  3K  [R0402]  48.25,152.5 270 bottom
R151  100K  [R0402]  9.75,104.5 90 bottom
R152  1K  [R0402]  11.5,98.75 270 bottom
R153  12K  [R0402]  40.75,151.5 270 bottom
R154  3K  [R0402]  40.75,153.5 270 bottom
R155  100K  [R0402]  10.75,104.5 270 bottom
R156  1K  [R0402]  59,152.5 90 bottom
R157  11K  [R0402]  57.5,152.5 270 bottom
R158  1K  [R0402]  65,153.5 270 bottom
R159  11K  [R0402]  65,151.5 270 bottom
R160  12K  [R0402]  72.5,152.5 90 bottom
R161  3K  [R0402]  74,152.5 270 bottom
R162  12K  [R0402]  66.5,151.5 270 bottom
R163  300  [R0603]  33.75,107.25 270 bottom
R164  300  [R0603]  30.5,107.25 270 bottom
R165  100K  [R0402]  9.75,72 0 bottom
R166  100k  [R0402]  2.75,70 90 bottom
R167  5.1k  [R0402]  6.75,68.25 0 bottom
R168  20K  [R0402]  31.25,132 0 bottom
R169  20K  [R0402]  57.25,132 0 bottom
R170  400  [R0603]  5.25,112 90 bottom
R171  10K  [R0402]  2.75,108.5 180 bottom
R172  51  [R0402]  37,2.75 0 bottom
R173  51  [R0402]  45.25,6 0 bottom
R174  3K  [R0402]  66.5,153.5 270 bottom
R175  54.9K  [R0402]  16.5,8.75 180 bottom
R176  49.9K  [R0402]  57.5,154.75 90 bottom
R177  4.7K  [R0402]  14.75,19.25 0 bottom
R178  49.9K  [R0402]  59,154.75 90 bottom
R179  4.7K  [R0402]  10.25,19.25 180 bottom
R180  10K  [R0402]  78.25,78.5 270 bottom
R181  10K  [R0402]  78.25,80.5 270 bottom
R182  240K  [R0402]  77.25,77.75 270 bottom
R183  240K  [R0402]  77.25,81 90 bottom
R184  240K  [R0402]  66.75,78 270 bottom
R185  240K  [R0402]  66.75,81 90 bottom
R186  1K  [R0402]  67.5,82.75 0 bottom
R187  1K  [R0402]  67.5,76.25 0 bottom
R188  1K  [R0402]  76.5,76 180 bottom
R189  1K  [R0402]  76.5,82.75 180 bottom
R190  49.9K  [R0402]  72.5,154.75 90 bottom
R191  49.9K  [R0402]  74,154.75 90 bottom
R192  49.9K  [R0402]  31.75,154.75 90 bottom
R193  49.9K  [R0402]  33.25,154.75 90 bottom
R194  10K  [R0402]  5.25,109.25 90 bottom
R195  49.9K  [R0402]  46.75,154.75 90 bottom
R196  49.9K  [R0402]  48.25,154.75 90 bottom
R197  49.9K  [R0402]  6,154.75 90 bottom
R198  49.9K  [R0402]  7.5,154.75 90 bottom
R199  10K  [R0402]  14.5,107.5 180 bottom
R200  10K  [R0402]  14.5,108.5 180 bottom
R201  10K  [R0402]  14.5,109.5 180 bottom
R202  10K  [R0402]  13,108.75 270 bottom
R203  1M  [R0402]  10,111 180 bottom
R204  3.9K  [R0402]  7.5,108.75 270 bottom
R205  47K  [R0402]  59,82.75 270 bottom
R206  49.9K  [R0402]  21,154.75 90 bottom
R207  49.9K  [R0402]  22.5,154.75 90 bottom
R208  20K  [R0402]  56.25,137 0 bottom
R209  20K  [R0402]  30.25,137 0 bottom
R210  10nF  [R0402]  67.25,137 0 bottom
R211  267  [R0402]  41.25,137 0 bottom
R212  49.9K  [R0402]  25.75,128.75 90 bottom
R213  49.9K  [R0402]  51.75,128.75 90 bottom
R214  49.9K  [R0402]  77.75,128.75 90 bottom
R215  100K  [R0402]  17.25,128.75 90 bottom
R216  20K  [R0402]  26.75,145 90 bottom
R217  20K  [R0402]  52.5,145 270 bottom
R218  20K  [R0402]  78.25,145 270 bottom
R219  100K  [R0402]  20.5,82.5 180 bottom
R220  10K  [R0402]  48.25,94.75 270 bottom
R221  10K  [R0402]  44.25,97.75 0 bottom
R222  10K  [R0402]  35.75,56 180 bottom
R223  267  [R0402]  15.75,137.25 0 bottom
R224  47K  [R0402]  74.25,83 0 bottom
R225  47K  [R0402]  70.75,76 0 bottom
R226  47K  [R0402]  73.25,76 180 bottom
R227  47K  [R0402]  69.75,83 180 bottom
R228  60K  [R0402]  28.5,146.75 180 bottom
R229  20K  [R0402]  28.5,145.75 0 bottom
R230  100K  [R0402]  8.75,158.75 180 bottom
R231  100K  [R0402]  8.75,161.25 180 bottom
R232  10K  [R0402]  60,82.75 90 bottom
R233  10K  [R0402]  56.5,84.25 180 bottom
R234  10K  [R0402]  54,82.25 270 bottom
R235  90  [R0402]  12,134.25 180 bottom
R236  90  [R0402]  58,140.25 270 bottom
R237  49.9K  [R0402]  24.75,128.75 90 bottom
R238  49K  [R0402]  50.75,128.75 90 bottom
R239  49.9K  [R0402]  76.75,128.75 90 bottom
R240  90  [R0402]  32,140.25 270 bottom
R241  4.7K  [R0402]  56.75,68.75 180 bottom
R242  4.7K  [R0402]  56,70 180 bottom
R243  10K  [R0402]  61.75,81.75 180 bottom
R244  10K  [R0402]  61.75,82.75 0 bottom
R245  10K  [R0402]  6.25,24.5 0 bottom
R246  10K  [R0402]  11.75,34 0 bottom
R247  510  [R0402]  44.25,81.5 270 bottom
R248  49.9k  [R0402]  43.25,81.5 90 bottom
R249  510  [R0402]  52.25,81.5 270 bottom
R250  100k  [R0402]  49.25,78.25 0 bottom
R251  20M  [R0402]  48.5,76.75 0 bottom
R252  510  [R0402]  44.25,71.5 90 bottom
R253  100k  [R0402]  43.25,71.5 270 bottom
R254  510  [R0402]  54.25,13.75 0 bottom
R255  5.1k  [R0402]  53,77.5 0 bottom
R256  100k  [R0402]  53,72 0 bottom
R257  5.1k  [R0402]  53,80 180 bottom
R258  24K  [R0402]  42.25,83.5 90 bottom
R259  10K  [R0402]  17.25,24.5 0 bottom
R260  10K  [R0402]  22.5,33.5 90 bottom
R261  10K  [R0402]  27.75,24 90 bottom
R262  10K  [R0402]  39.25,24.5 0 bottom
R263  10K  [R0402]  44.75,34 0 bottom
R264  10K  [R0402]  50.25,24.5 0 bottom
R265  10K  [R0402]  55.75,34 0 bottom
R266  10K  [R0402]  61.25,24.5 0 bottom
R267  10K  [R0402]  66.75,34 0 bottom
R268  10K  [R0402]  72.25,24.5 0 bottom
R269  10K  [R0402]  6.25,43.5 0 bottom
R270  10K  [R0402]  11.75,53 0 bottom
R271  10K  [R0402]  17.25,43.5 0 bottom
R272  10K  [R0402]  22.5,52.5 90 bottom
R273  10K  [R0402]  28,43 90 bottom
R274  10K  [R0402]  39.25,43.5 0 bottom
R275  10K  [R0402]  44.75,53 0 bottom
R276  10K  [R0402]  50.25,43.5 0 bottom
R277  10K  [R0402]  55.75,53 0 bottom
R278  10K  [R0402]  61.25,43.5 0 bottom
R279  10K  [R0402]  66.75,53 0 bottom
R280  10K  [R0402]  72.25,43.5 0 bottom
R281  10K  [R0402]  72.25,14.75 0 bottom
R282  10K  [R0402]  61.25,14.75 0 bottom
R283  10K  [R0402]  43.5,103.25 0 bottom
R284  10K  [R0402]  54.5,97.75 0 bottom
R285  910  [R0402]  26.75,4.25 270 bottom
R286  499K  [R0402]  14.5,131.75 270 bottom
R287  6.2K  [R0402]  26,1 0 bottom
R288  499K  [R0402]  38,132.75 270 bottom
R289  499K  [R0402]  64,132.75 270 bottom
R290  100K  [R0402]  18.5,79.5 0 bottom
R291  47K  [R0402]  28.5,101.5 180 bottom
R292  10K  [R0402]  31,35.5 0 bottom
R293  [R0402]  8.75,82.75 0 bottom
R294  [R0402]  41.75,81.5 90 bottom
R295  10K  [R0402]  32.75,30.5 270 bottom
R296  10K  [R0402]  35.25,30 90 bottom
R297  10K  [R0402]  32.25,49 270 bottom
R298  10K  [R0402]  33.25,49 270 bottom
R299  10K  [R0402]  34.25,49 270 bottom
R300  10K  [R0402]  35.25,49 90 bottom
R301  10K  [R0402]  52,98.75 90 bottom
R302  10K  [R0402]  53,98.25 90 bottom
R303  10K  [R0402]  51.25,95 180 bottom
R304  10K  [R0402]  50.75,94 180 bottom
R305  10K  [R0402]  49.25,94.75 270 bottom
RELEASE  100K  [9MM_SNAP-IN_POT]  72,67.5 0 top
SUSTAIN  100K  [9MM_SNAP-IN_POT]  56.5,67.5 0 top
SV2  [2X03]  77,53 270 top
T1  BC847  [SOT23]  4,105.75 270 bottom
U1  DAC8564IAPW  [SOP65P640X120-16N]  72,72.5 0 bottom
U2  6N137S  [8-SMD]  64,5.25 90 top
U3  ATMEGA328P-MUR  [QFN50P500X500X100-33N]  59.5,73.5 270 bottom
U4  TCA9535RTWR  [QFN50P400X400X80-25N]  34.5,34 0 bottom
U5  TCA9535RTWR  [QFN50P400X400X80-25N]  34.5,53 0 bottom
U16  LT3471EDDPBF  [DFN300X300X80-11N]  12.5,11.5 90 bottom
U17  TCA9535RTWR  [QFN50P400X400X80-25N]  48.5,98.75 225 bottom
U19  LM4040  [SOT23-3]  12,136.5 0 bottom
U20  LM4040  [SOT23-3]  34.25,140.25 90 bottom
U21  LM4040  [SOT23-3]  60.25,140.25 90 bottom
U$1  SSI2130_V2QFN-32  [QFN40P400X400X80-33T270N]  43.75,133 0 bottom
U$2  SSI2130_V2QFN-32  [QFN40P400X400X80-33T270N]  69.75,133 0 bottom
U$3  LM358QT  [SON50P200X200X60-9N]  22.25,144.25 0 bottom
U$4  LM358QT  [SON50P200X200X60-9N]  48,144.25 0 bottom
U$5  AS3310DSO-16  [SO16]  35.5,76.5 0 bottom
U$6  LM358QT  [SON50P200X200X60-9N]  73.75,144.25 0 bottom
U$7  SSI2130_V2QFN-32  [QFN40P400X400X80-33T270N]  18.25,133 0 bottom
U$8  TL2203  [TL2203]  23.5,112.75 0 top
U$9  LT2201  [LT2201]  7,24.5 0 top
U$10  LT2201  [LT2201]  12.5,34 0 top
U$11  LT2201  [LT2201]  18,24.5 0 top
U$12  LT2201  [LT2201]  23.5,34 0 top
U$13  LT2201  [LT2201]  29,24.5 0 top
U$14  LT2201  [LT2201]  40,24.5 0 top
U$15  LT2201  [LT2201]  45.5,34 0 top
U$16  LT2201  [LT2201]  51,24.5 0 top
U$17  LT2201  [LT2201]  56.5,34 0 top
U$18  LT2201  [LT2201]  62,24.5 0 top
U$19  NRS4018T100MDGJNRS4018T100MDGJ  [INDDFN400X400X180-2N]  18,16.5 270 bottom
U$20  NRS4018T100MDGJNRS4018T100MDGJ  [INDDFN400X400X180-2N]  12.5,16.5 90 bottom
U$21  LT2201  [LT2201]  67.5,34 0 top
U$22  LT2201  [LT2201]  73,24.5 0 top
U$23  LT2201  [LT2201]  7,43.5 0 top
U$24  LT2201  [LT2201]  12.5,53 0 top
U$25  LT2201  [LT2201]  18,43.5 0 top
U$26  LT2201  [LT2201]  23.5,53 0 top
U$27  LT2201  [LT2201]  29,43.5 0 top
U$28  LT2201  [LT2201]  40,43.5 0 top
U$29  LT2201  [LT2201]  45.5,53 0 top
U$30  LT2201  [LT2201]  51,43.5 0 top
U$31  LT2201  [LT2201]  56.5,53 0 top
U$32  LT2201  [LT2201]  62,43.5 0 top
U$33  LT2201  [LT2201]  67.5,53 0 top
U$34  LT2201  [LT2201]  73,43.5 0 top
U$35  TL2203  [TL2203]  31,112.75 0 top
U$36  LM311PWTSSOP-8  [TSSOP8]  34.25,133.5 90 bottom
U$37  OPA1652WSON-8  [SON50P300X300X80-9T120X200N]  30.25,134.5 90 bottom
U$38  LM311PWTSSOP-8  [TSSOP8]  60.25,133.5 90 bottom
U$39  OPA1652WSON-8  [SON50P300X300X80-9T120X200N]  56.25,134.5 90 bottom
U$40  TL2203  [TL2203]  53.5,112.75 0 top
U$41  TL2203  [TL2203]  61,112.75 0 top
U$42  OPA1652WSON-8  [SON50P300X300X80-9T120X200N]  20.5,76.5 90 bottom
U$43  TL2203  [TL2203]  38.5,112.75 0 top
U$44  TL2203  [TL2203]  68.5,112.75 0 top
U$45  NRS4018T100MDGJNRS4018T100MDGJ  [INDDFN400X400X180-2N]  5.5,16.5 90 bottom
U$46  MBRM120LT3G  [DIO_MBRM110LT1G]  16.5,12 0 bottom
U$47  MBRM120LT3G  [DIO_MBRM110LT1G]  5.5,11.75 90 bottom
U$48  PEC11L-4215_S00  [XDCR_PEC11R-4215F-S0024]  69.25,101.5 90 top
U$49  SFH11-PBPC-D13-RA-BK  [FE13-2W]  26,158.75 180 top
U$51  TL2203  [TL2203]  46,112.75 0 top
U$53  WP914HDT  [WP914HDT]  58,106.5 270 top
U$54  SSI2162SSOP10  [SOP100P600X150-10N]  44.25,76.5 270 bottom
U$55  OPA1652WSON-8  [SON50P300X300X80-9T120X200N]  53,75 90 bottom
U$56  OPA1652WSON-8  [SON50P300X300X80-9T120X200N]  49.25,73.75 270 bottom
U$57  TL2203  [TL2203]  76,112.75 0 top
U$58  OPA1652WSON-8  [SON50P300X300X80-9T120X200N]  10,108.75 0 bottom
U$59  LT2201  [LT2201]  43,99 270 top
U$60  TL2203  [TL2203]  40,153.25 0 top
U$61  LM358QT  [SON50P200X200X60-9N]  6.75,73 0 bottom
U$62  LM358QT  [SON50P200X200X60-9N]  65.75,144 0 bottom
U$63  LM358QT  [SON50P200X200X60-9N]  65.75,120 0 bottom
U$64  LM358QT  [SON50P200X200X60-9N]  52.88,120 0 bottom
U$65  LM358QT  [SON50P200X200X60-9N]  40,144 0 bottom
U$66  LT2201  [LT2201]  54,99 90 top
U$67  LT2201  [LT2201]  73,14.75 0 top
U$68  LT2201  [LT2201]  62,14.75 0 top
U$69  LM358QT  [SON50P200X200X60-9N]  40,120 0 bottom
U$70  LM358QT  [SON50P200X200X60-9N]  27.12,120 0 bottom
U$71  TL2203  [TL2203]  16,112.75 0 top
U$72  TL2203  [TL2203]  34,97.75 0 top
U$73  LM358QT  [SON50P200X200X60-9N]  14.25,148 180 bottom
U$74  WP483SRSGW  [WP483SRSGW]  8,112.75 0 top
U$75  LM358QT  [SON50P200X200X60-9N]  14.25,120 0 bottom
U$76  LM358QT  [SON50P200X200X60-9N]  8,121 90 bottom
U$77  TL2203  [TL2203]  19,105.25 0 top
U$78  LM358QT  [SON50P200X200X60-9N]  8,101.5 90 bottom
U$79  TL2203  [TL2203]  19,97.75 0 top
U$80  TL2203  [TL2203]  26.5,105.25 0 top
U$81  TL2203  [TL2203]  26.5,97.75 0 top
U$82  LM358QT  [SON50P200X200X60-9N]  6.75,70 180 bottom
U$83  SSI2144  [TSSOP16]  25.75,76.5 0 bottom
U$84  LM358QT  [SON50P200X200X60-9N]  72,85.5 270 bottom
U$85  LM358QT  [SON50P200X200X60-9N]  11.25,64.75 90 bottom
U$86  ADAFRUIT_JOYSTICK  [ADAFRUIT-JOYSTICK]  10,69.5 270 top
U$87  LM358QT  [SON50P200X200X60-9N]  4,64.75 270 bottom
U$88  MC33178DMR2GSO-MINI8  [SOP65P490X110-8N]  2.75,112 90 bottom
U$89  TMUX6219DGKRSO-MINI8  [SOP65P490X110-8N']  56.5,88 0 bottom
U$90  SSI2162SSOP10  [SOP100P600X150-10N]  6.75,79.5 0 bottom
U$91  LM358QT  [SON50P200X200X60-9N]  56.5,82.25 0 bottom
U$92  TL2203  [TL2203]  14.25,153.25 0 top
U$93  LM358QT  [SON50P200X200X60-9N]  17.25,144.25 0 bottom
U$94  LM358QT  [SON50P200X200X60-9N]  44.5,144 270 bottom
U$95  TL2203  [TL2203]  65.75,153.25 0 top
U$96  LM358QT  [SON50P200X200X60-9N]  70.25,144 270 bottom
U$97  WP914HDT  [WP914HDT]  53.25,106.5 270 top
U$98  WP914HDT  [WP914HDT]  50.25,106.5 270 top
U$99  WP914HDT  [WP914HDT]  47.25,106.5 270 top
U$100  WP914HDT  [WP914HDT]  44.25,106.5 270 top
U$101  WP914HDT  [WP914HDT]  41.25,106.5 270 top
U$102  WP914HDT  [WP914HDT]  38.25,106.5 270 top
U$103  WP914HDT  [WP914HDT]  35.25,106.5 270 top
U$104  WP914HDT  [WP914HDT]  32.25,106.5 270 top
U$105  NC7SB3157P6XSC-70-6  [SOT65P210X110-6N]  40,147 0 bottom
U$106  NC7SB3157P6XSC-70-6  [SOT65P210X110-6N]  46.25,120.5 0 bottom
U$107  NC7SB3157P6XSC-70-6  [SOT65P210X110-6N]  33.75,120.5 0 bottom
U$108  NC7SB3157P6XSC-70-6  [SOT65P210X110-6N]  65.75,147 0 bottom
U$109  NC7SB3157P6XSC-70-6  [SOT65P210X110-6N]  72,120.5 0 bottom
U$110  NC7SB3157P6XSC-70-6  [SOT65P210X110-6N]  59.5,120.5 0 bottom
U$111  TPS259620DDARSOIC-8  [SOIC127P600X170-9T240X310N]  22.25,4.25 180 bottom
VCO1_FINE  100k  [9MM_SNAP-IN_POT]  8,141 180 top
VCO1_FINE1  100k  [9MM_SNAP-IN_POT]  33.75,141 180 top
VCO1_FINE2  100k  [9MM_SNAP-IN_POT]  59.5,141 180 top
VR1  3223W-1-501  [TRIM_3223W-1-501]  11.75,131 0 bottom
VR2  [9MM_SNAP-IN_POT]  20.5,141 180 top
VR3  [9MM_SNAP-IN_POT]  20.5,125 0 top
VR4  [9MM_SNAP-IN_POT]  8,125 0 top
VR5  3223W-1-501  [TRIM_3223W-1-501]  23.5,131.75 180 bottom
VR6  [9MM_SNAP-IN_POT]  56.5,85.5 180 top
VR7  3223W-1-501  [TRIM_3223W-1-501]  38,136.75 270 bottom
VR8  [9MM_SNAP-IN_POT]  46.25,141 180 top
VR9  [9MM_SNAP-IN_POT]  25.5,85.5 180 top
VR10  [9MM_SNAP-IN_POT]  41,85.5 180 top
VR11  [9MM_SNAP-IN_POT]  46.25,125 0 top
VR12  [9MM_SNAP-IN_POT]  33.75,125 0 top
VR13  TC33X-2-103G  [TRIMMER_TC33X-2-103G]  49,82 270 bottom
VR14  3223W-1-501  [TRIM_3223W-1-501]  49,131.75 180 bottom
VR15  TC33X-2-103G  [TRIMMER_TC33X-2-103G]  20.5,140.5 90 bottom
VR16  TC33X-2-103G  [TRIMMER_TC33X-2-103G]  15,66.25 0 bottom
VR17  [9MM_SNAP-IN_POT]  8,85.5 180 top
VR18  TC33X-2-103G  [TRIMMER_TC33X-2-103G]  46.25,140.25 90 bottom
VR19  TC33X-2-103G  [TRIMMER_TC33X-2-103G]  72,89.25 90 bottom
VR20  TC33X-2-103G  [TRIMMER_TC33X-2-103G]  72,140.25 90 bottom
VR21  [9MM_SNAP-IN_POT]  8,101.5 0 top
VR22  3223W-1-501  [TRIM_3223W-1-501]  64,136.75 270 bottom
VR23  [9MM_SNAP-IN_POT]  72,85.5 180 top
VR24  TC33X-2-103G  [TRIMMER_TC33X-2-103G]  32.25,102.5 90 bottom
VR25  [9MM_SNAP-IN_POT]  72,141 180 top
VR26  [9MM_SNAP-IN_POT]  72,125 0 top
VR27  [9MM_SNAP-IN_POT]  59.5,125 0 top
VR28  3223W-1-501  [TRIM_3223W-1-501]  75,131.75 180 bottom
VR29  TC33X-2-103G  [TRIMMER_TC33X-2-103G]  12.5,77.5 0 bottom
VR30  TC33X-2-103G  [TRIMMER_TC33X-2-103G]  4,59 90 bottom
VR31  TC33X-2-103G  [TRIMMER_TC33X-2-103G]  16.75,85.5 90 bottom
Y1  ABM8G-16.000MHZ-18-D2Y-T  [OSCSC320X250X100N]  64.25,78.25 180 bottom

## Tracks (layer width: path | path; a pad name or v marks a point on that pad's centre or on a via)
1/2VREF
  Bottom 0.254: R181.2 R180.1 78.17,79.08 75.42,79.08 75.2,78.86 IC1.5 IC1.10 69.44,79.02 70.45,79.02 70.73,79.3 70.73,79.7 70.45,79.98 69.44,79.98 IC1.12 IC1.3
2.5_VREF_1
  Bottom 0.152: U$7.23 14.75,134 14.52,134.23
  Bottom 0.254: 14.52,134.23 R116.1 R7.1 R235.2 12.95,134.7 U19.1
2.5_VREF_2  (via drill 0.2 pad 0.45)
  Top 0.254: v36.75,139 36.75,138.75 37,138.5 v37,134.75 | v29,131.25 29.5,131.75 29.5,133.5 29.25,133.75 29.25,138.25 v30.75,139.75
  Bottom 0.152: U$1.23 R20.1
  Bottom 0.254: v36.75,139 36.45,139.3 U20.1 33.25,139.75 R240.2 v30.75,139.75 | R20.1 R28.1 v37,134.75 | v29,131.25 R55.1
2.5_VREF_3  (via drill 0.2 pad 0.45)
  Top 0.254: v55,131.25 55.5,131.75 55.5,133.5 55.25,133.75 55.25,138.25 v56.75,139.75 | v63,134.75 63,138.5 v62.25,139.25
  Bottom 0.152: U$2.23 R42.1
  Bottom 0.254: v62.25,139.25 62.2,139.3 U21.1 59.25,139.75 R236.2 v56.75,139.75 | R42.1 R43.1 v63,134.75 | v55,131.25 R63.1
5V_UNREG  (via drill 1)
  Top 1.016: C42.1 9.6,13.18 C46.1
  Bottom 0.508: 4.3K.2 17.91,6.16 U$111.4
  Bottom 1.016: v18.75,7.5 18.75,6.91 U$111.4 20.5,7.16 v20.5,7.5
  pour Top (no thermals): 14.55,7.75 14.55,5.7 9.45,5.7 9.45,7.75
  pour Top: 14.5,7.75 14.75,8 17.25,8 17.75,7.5 17.75,6.5 21.5,6.5 21.5,8.5 19.75,10.25 13.25,10.25 10.75,7.75
  pour Top (no thermals): 9.45,7.7 9.15,8 9.15,10.4 10.35,10.4 10.35,7.7
+5V  (via drill 0.2, 0.2 pad 0.45, 0.35 pad 0.45, 0.5, 1)  (1 unrouted)
  Top 0.254: U2.8 60.47,1.22 v60.5,1.25 | v0.75,92.25 0.75,72 U$86.P$1 1.27,71.5 2.31,70.46 2.31,66.31 1.75,65.75 1.75,57.75 v2.5,57 | v18.25,150.75 18.25,148.25 VR2.3 | VR8.3 v43.75,150.75 | VR25.3 v69.5,150.75 | v55.5,87.25 55,87.75 55,91 55.25,91.25 v55.25,95.75 | v38,147 38,149.25 v36.5,150.75 | v63.75,147 63.75,149.25 v62.25,150.75 | v9.75,66 12,63.75 U$86.P$4 v12,57.5
  Top 1.016: U$49.22 15.84,162.59 v16,162.75
  Bottom 0.152: U$1.27 43.15,136.35 | U$2.27 69.15,136.35 | 17.65,136.35 U$7.27
  Bottom 0.254: U$38.8 61.23,136.77 61.6,137.15 v61.6,137.5 | 43.15,136.35 R8.2 43,137.75 C10.1 v42.85,138.6 | U$36.8 35.23,135.53 v35.5,135.25 | R59.1 v35.75,131.75 | 69.15,136.35 R30.2 69,137.6 C15.1 v68.85,138.6 | R149.1 v46.75,151.25 | 17.65,136.35 R70.2 17.5,137.6 C2.1 v17.35,138.6 | R153.2 40.25,151 v40,150.75 | R69.2 v63,6.25 | R172.1 v38.25,2.75 | R177.1 v16,19.25 | R179.1 v9,19.25 | U16.8 v12.5,14 | U4.21 v34.25,36.75 C64.1 | U5.21 v34.25,55.75 34.25,56.9 C76.1 | v7.5,57 v2.5,57 | VR17.3 1,92.5 v0.75,92.25 | U$75.8 v12.5,120.75 | U$76.8 v8.75,122.75 | U$69.8 v38.25,120.75 | U$63.8 v64,120.75 | U$70.8 v25.25,120.75 | U$64.8 51.85,121.11 v52,121.25 | R235.1 v10.75,134.25 | R242.2 v58.4,70 | v58.4,68.75 R241.2 | R246.1 v13,34 | R260.1 v22.5,32.25 | R261.1 v27.75,22.75 | R259.1 v18.5,24.5 | R245.1 v7.5,24.5 | R264.1 v50.75,23.75 | R266.1 v62.5,24.5 | R268.1 v73.5,24.5 | R281.1 v73.5,14.75 | R267.1 v68,34 | R282.1 v62.5,14.75 | R265.1 v57,34 | R263.1 v46,34 | R274.1 v40.5,43.5 | R276.1 v50.75,42.75 | R278.1 v62.5,43.5 | R280.1 v73.5,43.5 | R279.1 v68,53 | R277.1 v57,53 | R275.1 v46,53 | R272.1 v22.5,51.25 | v13,53 R270.1 | R269.1 v7.5,43.5 | R271.1 v18.5,43.5 | R273.1 v28,41.75 | R262.1 v40.5,24.5 | R284.1 v55.75,97.75 | R67.1 v61.75,131.75 | R240.1 31.75,140.5 v31.25,140.5 | R283.1 v44.75,103.25 | U$89.5 55.27,87.03 v55.5,87.25 | U$105.5 v38,147 | U$108.5 v63.75,147 | U$110.5 v57.5,120.5 | U$109.5 v70,120.5 | U$106.5 44.5,120.5 v44.25,120.25 | U$107.5 v31.75,120.5 | v72.5,151.25 R160.1 | R133.1 v21,151.25 | R45.2 v9.75,66 | U3.18 60.74,69.94 C45.1 61.4,69.85 v61.5,69.75 | U1.12 67.83,72.17 v67.75,72.25 | C63.1 59.25,77.85 v59.25,76.75 U3.4 | U3.6 60.25,75.98 v60.25,76.75 60.25,77.85 C49.1 61.1,78.1 61.5,78.5 61.5,80.25 62.25,81 R243.2
  Bottom 0.254: R162.2 66.25,150.75 v65.75,150.75 | R142.2 14.75,150.75 v14.25,150.75 | v57.25,140.5 57.5,140.75 R236.1 | R221.2 v43,97.75 | R292.2 v29.75,35.5 | C77.1 46.5,95.1 46.5,96.4 v46.75,96.65 U17.21 | R222.2 v37,56
  Bottom 0.406: C62.1 77.03,72.83 U1.4 | C48.1 77.35,70.35 v77.25,70.25
  Bottom 0.508: R164.2 v30.5,105.25 | R163.2 33.5,106.15 v33.5,105.25 | R123.2 v36.75,105.25 | R122.2 v39.75,105.25 | R121.2 v42.75,105.25 | R114.2 v45.75,105.25 | R81.2 48.75,105.5 v48.5,105.25 | R54.2 v51.75,105.25 | R27.2 v56.5,105.25 | C48.1 C62.1
  Bottom 1.016: v19,19.5 19,18.9 U$19.1 17.25,18.65 v17.25,19.5 | v24.25,7.5 24.25,6.91 U$111.5 26,7.16 v26,7.5
  Bottom 1.27: U$20.2 U$19.1
  pour Route2: 24.5,-1 24.5,31.25 7.25,31.25 7.25,57.75 72.75,57.75 72.75,94.75 81.5,94.75 81.5,-1
  pour Route2: 55.25,94.5 55.25,111 7.75,111 7.75,140.75 81.5,140.75 81.5,94.5
  pour Route2: 81.5,139.75 81.5,155.5 4.5,155.5 4.5,148 73.25,148 73.25,139.75
  pour Route2: -1,6.75 17.5,6.75 17.75,6.5 17.75,1.75 20.5,-1 24.5,-1 24.5,9.75 19.75,9.75 19.75,27.25 -1,27.25
  pour Route2: 55.5,58 55.5,77.75 74.5,77.75 74.5,58
  pour Route2: 55.25,94.75 30,94.75 30,111 55.25,111
  pour Route2: 56.75,155.25 56.75,162 13,162 13,164 62.75,164 62.75,155.25
+12V  (via drill 0.2, 0.2 pad 0.45, 1 pad 0.45)
  Top 0.254: v32,136 32,142.5 v32.25,142.75 | v58,136 58,142.5 v58.25,142.75 | v19.75,139.5 v19.75,142 | v71.25,139.5 v71.25,141.75
  Bottom 0.2: R111.1 v54.25,59
  Bottom 0.254: v48.5,71.45 U$56.8 | U$37.8 31.89,135.88 v32,136 | U$55.8 53.88,76.39 v54.25,76.75 | C70.1 42,73.78 U$54.10 v41.5,74.03 | U$58.8 8.62,109.86 v8.75,110 | U$42.8 21.61,77.89 v21.75,77.75 | 4.25,81.53 U$90.10 4.35,81.57 C73.1 4.35,83.6 v4.5,83.75 | U$78.8 9.23,102.52 v9.25,102.5 | U$82.8 8.02,69.25 8.52,68.75 v9.01,68.75 | U$61.8 v5,73.75 | U$85.8 v12,66.5 | U$87.8 v3.25,63 | IC1.4 v71.5,79.5 | U$84.8 71.23,84.5 v70.75,84.5 | U$89.4 59.73,87.03 v59.75,87 | U$91.8 v54.75,83 | U$93.8 v15.5,145 | U$94.8 43.27,142.98 v43.25,143 | U$65.8 v38.25,144.75 | U$62.8 v64,144.75 | U$73.8 v16,147.25 | U$39.8 57.88,135.88 v58,136 | U$96.8 69.02,142.98 v69,143 | VR15.1 v19.75,139.5 | VR18.1 45.25,139.25 v45.5,139.5 v45.5,141.75 | VR20.1 71,139.25 v71.25,139.5 | R175.2 17,9.85 C9.1 17.15,11.95 U$46.1 | v33.59,78 U$5.11 | U$83.16 28.55,78.9 v28.6,78.9 C75.1 | U$88.8 3.73,115.03 3.25,115.5 v3,115.5 | R293.2 v7.5,82.75 | R294.2 v41,82
  Bottom 1.016: v21.75,13.25 20.85,13.25 C17.1 | v21.75,11.5 20.9,11.5 C17.1 | U$46.1 17.6,12.4 C17.1
  pour Route2: 6.5,28 6.5,58.5 54.75,58.5 54.75,94 -1,94 -1,28
  pour Route2: 7,109 7,141.5 72.5,141.5 72.5,147.25 -1,147.25 -1,109
  pour Route2: 3.75,147 3.75,156.25 56,156.25 56,161.25 -1,161.25 -1,147
  pour Route2: 20.5,10.5 23.75,10.5 23.75,30.5 6.5,30.5 6.5,28 20.5,28
  pour Route2: 72,78.5 53.75,78.5 53.75,94 72,94
  pour Route2: -1,94 -1,110.25 29.25,110.25 29.25,94
-12V  (via drill 0.2 pad 0.45, 0.35, 0.5, 0.5 pad 0.45, 1 pad 0.45)
  Bottom 0.152: v21.5,130.25 20.34,131.41 U$7.8 | U$1.8 46.65,131.6 v47.5,130.75 | v73.5,130.75 72.65,131.6 U$2.8
  Bottom 0.254: v46.9,74 46.28,74 U$54.6 46.25,72.78 46.75,72.28 C71.1 | U$58.4 11.38,107.39 v11.25,107.25 | R108.1 v33.59,69.81 v33.6,69.8 | R258.2 v43,84 | U$39.4 55.13,133.12 v55,133.25 | v16.75,76.5 R98.2 | v4.25,76.75 4.28,76.78 U$90.6 C72.1 | U$55.4 51.88,73.61 v51.75,73.75 | U$56.4 50.37,75.14 v50.5,75 | v31.75,151.5 R146.2 | R157.2 v57.5,151.25 | U$83.8 22.57,73.58 22.4,73.4 22.4,71 C74.1 v22.15,69.65 | v65.75,151.75 65.75,151.5 65.25,151 R159.2 | U$37.4 29.04,133.12 v29,133.15 | U$42.4 19.39,75.11 v19.25,75.25 | v40,151.5 39.5,151 R148.2 | R14.1 10.1,10 C8.2 10.25,10.75 9.5,11.5 v8.5,11.5 | IC1.11 v70.25,79.5 | R110.1 v46.75,60.5 | R109.1 v30.25,60 | R112.1 v76,59.25 | U$78.4 6.77,100.48 v6.75,100.5 | U$82.4 5.73,71.23 v5.75,71.25 | U$85.4 9.77,63.73 v9.75,63.75 | U$3.4 23.25,143.48 v23.25,142.75 | U$6.4 74.77,143.02 v74.75,143 | U$4.4 49.02,143.02 v49,143 | U$84.4 73.23,86.52 v73.25,86.5 | U$88.4 1.68,109.75 v1,109.75 | v28.5,134.25 v24.75,134.25 | v54.5,134.5 v51.75,134.5 | U$89.7 55.42,88.33 v55.5,88.25 | U$91.4 57.25,81.23 v57.25,81 | v54.5,80.25 v56.75,80.25 | U$87.4 4.77,65.75 v5.25,65.75 | v21.5,130.25 C4.1 | v47.5,130.75 C12.1 | v73.5,130.75 C20.1 | R128.2 v6,151.5 | R131.2 13.75,151 14.25,151.5 v14.25,151.75 | U$61.4 8.02,72 v8.5,72
  Bottom 0.508: v56.5,19.75 v62.5,19.75 | v19.25,101.25 v26.25,101.25 | v48,103.5 v50.25,103.5 | v5.25,116.25 v1.25,116.25
  Bottom 1.016: U$45.2 C16.1 | C16.1 1,18.65 v1,19.5 | C16.1 2.75,18.9 v2.75,19.5
  other vias: 53.5,75 52.5,75 48.75,73.75 49.75,73.75 20,76.5 21,76.5 29.75,134.5 30.75,134.5 55.75,134.5 56.75,134.5
  pour Top: -1,166 -1,11 81.5,11 81.5,166
A_IN_O2B1
  Bottom 0.254: R247.2 R248.1 U$54.2
A_IN_O2B2
  Bottom 0.254: R90.2 R91.1 U$90.2
AMP_ENV_OUT  (via drill 0.2 pad 0.45)
  Top 0.254: VR23.3 69,92 v69,88.25
  Bottom 0.254: U$84.1 70.48,86.52 70.2,86.8 VR19.1 v69,88.25
AREF_-2.1  (via drill 0.2 pad 0.45)
  Top 0.254: v42.75,76.75 42.58,76.92 v42.58,81.52
  Bottom 0.254: C52.1 C51.1 | v42.58,81.52 42.58,81.68 42.9,82 R248.2 43.25,82.75 43,83 R258.1 42.1,82.85 C51.1 | v42.75,76.75 R251.2 | IC13.2 39.9,85.55 39.69,85.55 38.9,84.75 38.9,83.59 39.64,82.85 C51.1
AREF_-2.2
  Bottom 0.254: R91.2 14.45,80.5 IC2.2 14.85,80.1 C69.1 C68.1 15,77.6 R98.1 15,74 14.75,73.75 12,73.75 11,74.75 10.5,74.75 R94.2
AUDIO_CV_EXT  (via drill 0.2 pad 0.45)
  Top 0.254: v18,156.25 17.66,155.91 17.66,150.62 16.67,149.64 16.67,143.01 18,141.68 18,133.43 17.77,133.2 17.77,132.8 18,132.57 18,128.25 v17.25,127.5
  Bottom 0.254: R215.1 v17.25,127.5 | v18,156.25 24.77,156.25 U$49.13
AUDIO_EXT  (via drill 0.2 pad 0.45)
  Top 0.254: v29.81,157.94 29.81,157.06 29,156.25 v29,147.5
  Bottom 0.254: U$49.16 24.73,158.75 29,158.75 v29.81,157.94 | v29,147.5 R228.2
CLK_EXT
  Bottom 0.254: U$49.19 17.11,158.75 R230.2
CLK_LED  (via drill 0.2 pad 0.45)
  Top 0.254: v58,100.75 U$53.C
  Bottom 0.254: U17.10 50.6,100.5 57.75,100.5 v58,100.75
CUTOFF_EXT  (via drill 0.2 pad 0.45)
  Top 0.254: v3,156 3,143.56 1.5,142.06 1.5,124 2.25,123.25 2.25,114.75 1.75,114.25 1.75,104.5 0.5,103.25 0.5,99.75 1.25,99 1.25,96.5 2,95.75 v2,88 | v22.5,82.5 23,83 23,87.25 v22.75,87.5
  Bottom 0.254: U$49.21 14.72,156.36 3.36,156.36 v3,156 | v2,88 2.25,87.75 22.5,87.75 v22.75,87.5 | R219.2 v22.5,82.5
DWAD
  Bottom 0.254: U$85.7 11.5,67 R126.2 13.25,67.25 14,66.5 VR16.3
ENCODER_A  (via drill 0.2 pad 0.45)
  Top 0.254: v64.25,73.25 64.5,73.5 v64.5,98.75
  Bottom 0.254: v64.5,98.75 64.75,99 U$48.A | U3.13 v64.25,73.25
ENCODER_B  (via drill 0.2 pad 0.45)
  Top 0.254: v64,103.75 64,74 v63.75,73.75
  Bottom 0.254: U$48.B 64.25,104 v64,103.75 | v63.75,73.75 U3.12
ENCODER_BUTTON  (via drill 0.2 pad 0.45)
  Top 0.254: U$48.1 63.5,97.75 63.5,83.75 62.75,83 v62.75,74.25
  Bottom 0.254: U3.11 61.98,74.25 v62.75,74.25
ENV_OUT  (via drill 0.2, 0.2 pad 0.45)
  Top 0.254: v30.25,81.4 30.25,75.25 v30.5,75 | v72.25,87.25 v72.25,83.5 72.25,65.75 v72,65.5 | v39,65.75 39,68.5 38.75,68.75 v38.75,72
  Bottom 0.254: R106.2 30.35,81.5 v30.25,81.4 | U$84.3 v72.25,87.25 | v72,65.5 39.25,65.5 v39,65.75 | R232.2 60.25,83.5 68.5,83.5 68.75,83.75 70.75,83.75 71,83.5 v72.25,83.5 | v30.5,75 38.25,75 38.67,74.58 U$5.2 38.67,72.08 v38.75,72
FB2P
  Bottom 0.254: U16.4 11.99,9.24 R2.1 11.6,8.85 C8.1 10.1,9 R14.2
FILTER_LFO  (via drill 0.2 pad 0.45)
  Top 0.254: v18,84.25 v18,80.25
  Bottom 0.254: VR31.2 18.2,84.45 v18,84.25 | v18,80.25 R290.2
FILTER_OUT  (via drill 0.2 pad 0.45)
  Top 0.254: v43.25,70.3 43.25,75.25 v43,75.5
  Bottom 0.254: R85.2 21.15,72.4 C29.1 21.25,73.6 U$42.1 21.64,75.5 v43,75.5 | R253.2 v43.25,70.3
FREQ_LFO  (via drill 0.2 pad 0.45)
  Top 0.254: v34.25,116.25 v34.25,103.75 | v37.25,132.25 37.25,131.93 37.73,131.45 37.73,131.05 37,130.32 37,127.75 36.25,127 36.25,123.75 37,123 37,119.75 38,118.75 v38,116.25 | v12.25,116.5 12.25,120.25 10.5,122 10.5,130.25 v11.25,131 | v63.75,116.5 63.75,118.75 62.75,119.75 62.75,122.75 62,123.5 62,126.75 63,127.75 63,130.32 63.73,131.05 63.73,131.45 63.25,131.93 v63.25,132.25
  Bottom 0.254: v14.5,130.5 R286.2 11.5,131.25 v11.25,131 | v37.25,132.25 R288.2 | VR24.2 34.25,103.05 v34.25,103.75 | v12.25,116.5 12.5,116.25 24.25,116.25 25,117 27.75,117 28.5,116.25 v34.25,116.25 v38,116.25 63.5,116.25 v63.75,116.5 | v63.25,132.25 R289.2
GATE  (via drill 0.2, 0.2 pad 0.45)
  Top 0.254: v34.75,64.75 34.5,65 34.5,69.25 v34.75,69.5 | v62.75,64.75 63,65 63,72.25 63.25,72.5 v63.25,74.75
  Bottom 0.2: 36.15,73.42 U$5.4
  Bottom 0.254: 36.15,73.42 C36.2 36.15,70.4 R107.2 36,70 35.5,69.5 v34.75,69.5 | U3.10 v63.25,74.75 | v62.75,64.75 v34.75,64.75
GATE_EXT
  Bottom 0.254: U$49.20 17.15,161.25 R231.2
GND  (via drill 0.2, 0.2 pad 0.4, 0.2 pad 0.45, 0.35 pad 0.45, 0.5, 0.5 pad 0.45, 1, 1 pad 0.45)  (3 unrouted)
  Top 0.254: U2.5 58.34,8.84 v58.25,8.75
  Top 0.508: J4.12 15.1,7.1 v15.25,7.25 | J4.1 8.9,7.1 v8.75,7.25 | J2.1 52.9,2.4 v52.75,2.25 | J3.1 45.6,2.4 v45.75,2.25
  Top 1.016: C42.2 C28.2 7.9,8.1 v8.75,7.25 | C46.2 v3.5,13.25
  Bottom 0.152: U$1.20 40.55,132.8 40.05,132.3 v40,132.3 | U$1.15 42.7,130.91 U$1.16 41.91,130.91 v41.75,130.75 | U$7.15 17.2,130.91 U$7.16 16.34,130.91 v16.25,131 16.21,131.04 16.21,131.5 | 16.21,131.5 U$7.17 | U$7.20 U$7.19 16.2,132.39 15.63,132.39 15.41,132.16 15.41,131.84 15.63,131.61 16.1,131.61 16.21,131.5 | U$2.15 68.7,130.91 U$2.16 67.84,130.91 v67.75,131 | U$2.20 66.55,132.8 v66,132.25
  Bottom 0.254: U$5.7 32.33,71.83 v32.25,71.75 | C51.2 C52.2 v41,85 41.4,85.4 IC13.1 | U$56.6 v49.5,71.45 | U$54.5 47,79.72 v47,79.75 | U1.5 U1.6 76.22,71.53 v76.25,71.5 | U1.13 U1.14 | U1.14 U1.15 U1.16 67.78,74.78 v67.75,74.75 | U1.14 69.11,73.5 | R137.1 v28,70.25 | U$42.5 19.39,77.89 v19.25,77.75 | R10.1 R11.1 v49.25,134.5 | VR14.3 50.4,134.1 v50.25,134.25 | Q2.C v37.75,128.75 | R60.1 v35.5,128.25 | v41.75,127.75 R88.1 42.4,128.5 C13.2 | C12.2 v47.5,127.35 | C10.2 45,137.75 R6.2 v45.25,138.25 | U$38.4 59.2,130.5 v58.25,130.5 | R68.1 v61.5,128.25 | 70.25,141.3 VR20.3 70.2,140.95 v69.5,140.25 | VR15.3 v18.7,142.5 | C15.2 71,137.75 R29.2 v71.25,138.2 | v67.75,127.75 R89.1 68.4,128.5 C21.2 | C20.2 v73.5,127.35 | R32.1 R33.1 v75,134.5 | U$90.5 v7.75,77.5 | R92.1 v14.25,74.5 | C65.2 v10,82.75 | IC2.1 16.15,80.1 C69.2 C68.2 v17,77.75 | R155.2 v11.5,104 | v28,84.25 27.85,84.1 C47.2 | U$55.5 51.88,76.39 v51.75,76.25 | U$38.1 61.5,130.3 v61.5,129.5 | Q3.C v63.75,128.75 | C70.2 v42,70.1 | C71.2 46.75,70.9 | C72.2 1.2,78.5 v1.25,78.55 | U$36.4 33.02,130.82 32.58,130.82 v32.5,130.75 | R147.1 v40,154 R154.1 | v76.5,134.25 76.4,134.15 VR28.3 | C74.2 v20,70.75 | C2.2 19.5,137.75 R1.2 v19.75,138.25 | R72.1 R73.1 v23.5,134.5 | C4.2 v21.5,127.35 | C5.2 v15.1,127.65 | C37.2 v30.25,70.35 | R136.1 v5.75,98 | C35.2 v40.8,70.35 | U$58.5 8.62,107.64 v8.75,107.5 | VR5.3 24.11,132.89 v24,133 | R144.1 v33.25,151.5 | R150.2 v48.25,151.25 | R156.1 v59,151.25 | v16.25,20.5 C18.2 | C25.2 v8.75,20.5 | U16.5 11.51,10.81 v11.8,11.1 | U4.9 v34.75,31.25 | U5.9 v34.75,50.25 | VR30.1 v1,58 | U$82.5 7.77,71.23 v7.75,71.25 | U$61.5 v5,72.25 | U$85.5 v10.5,66.5 | U$87.5 v4.75,63 | U$84.5 72.77,84.5 v73.25,84.5 | U$6.3 v75.5,144
  Bottom 0.254: U$4.3 v49.75,144 | R31.2 v67.5,136 | R9.2 v41.5,136 | v16,136.25 R71.2 | C44.2 11,7.75 v10.75,8 | R181.1 v79,81 | R229.1 v29,145 | U$88.3 2.42,110.92 v2.5,111 | U$88.5 1.77,115.22 v1.75,115.25 | R107.1 34.55,70.25 v34.3,70.5 | U$83.9 22.82,79.42 v22.75,79.5 | U$89.3 59.67,87.67 v59.75,87.75 | U$91.5 v54.75,81.5 | U$65.5 v38.25,143.25 | U$62.5 v64,143.25 | U$73.5 v16,148.75 | U$73.4 v12.5,148.75 | U$70.4 v29,119.25 | U$70.5 v25.25,119.25 | U$75.4 v16,119.25 | 7.25,121.86 U$76.5 v6.75,122.02 | 7.25,120.14 U$76.4 7.23,120 v6.75,120 | U$93.3 U$93.4 v19,143.5 | U$93.5 v15.5,143.5 | U$3.8 v20.5,145 | U$94.3 U$94.4 45.52,145.02 v45.75,145.25 | U$4.8 46.5,145 v46.25,144.75 | U$4.5 46.98,143.02 v47,143 | VR18.3 44.45,140.95 v43.75,140.25 | U$94.5 45.27,143 v45.75,143 | U$6.8 72.25,145 v72,144.75 | U$96.5 71.02,143 v71.5,143 | U$96.3 U$96.4 71.27,145.02 v71.5,145.25 | U$63.4 66.77,119.02 v66.5,118.75 | v50.5,101 50.4,101 U17.9 | R249.1 v52.25,82.75 | U4.23 v35.25,36.75 | U4.24 v35.75,37.25 | U5.18 v31.75,54.25 | U17.24 45.98,98 v45.5,98 | U$64.5 51.85,118.89 v52,118.75 | U$3.3 23.75,144 24,143.75 v24,143.5 | U19.2 11.75,135.5 v12,135.25 | v59.25,142.25 U21.2 | U$6.5 72.75,143.48 v72.75,143 | VR16.1 16.95,64.45 v17,64.5 | VR19.3 v71.25,90.25 | v9.25,67 R46.1 | C67.2 v3.5,82.75 | C14.1 67.9,138.99 v68,139.09 | C6.1 41.9,138.99 v42,139.09 | C1.1 17,139.1 v17,139.25 | U20.2 33.3,141.25 v34.25,141.25 | v42.25,147 U$105.2 | U$108.2 v67.75,147 | U$62.4 67.25,143.25 v67.5,143 | U$65.4 41.5,143.25 v41.75,143 | U$106.2 v48.25,120.5 | U$110.2 v61.5,120.5 | U$109.2 v74,120.5 | U$107.2 v35.75,120.5 | U$36.1 35.5,130.3 v35.5,129.5 | R36.1 15.25,8.5 v15.25,7.25 | R101.2 37.53,79.7 U$5.14